# EAGLE design NSL_MiniQuad (EAGLE 5.11)

## Sheet 1 of 7
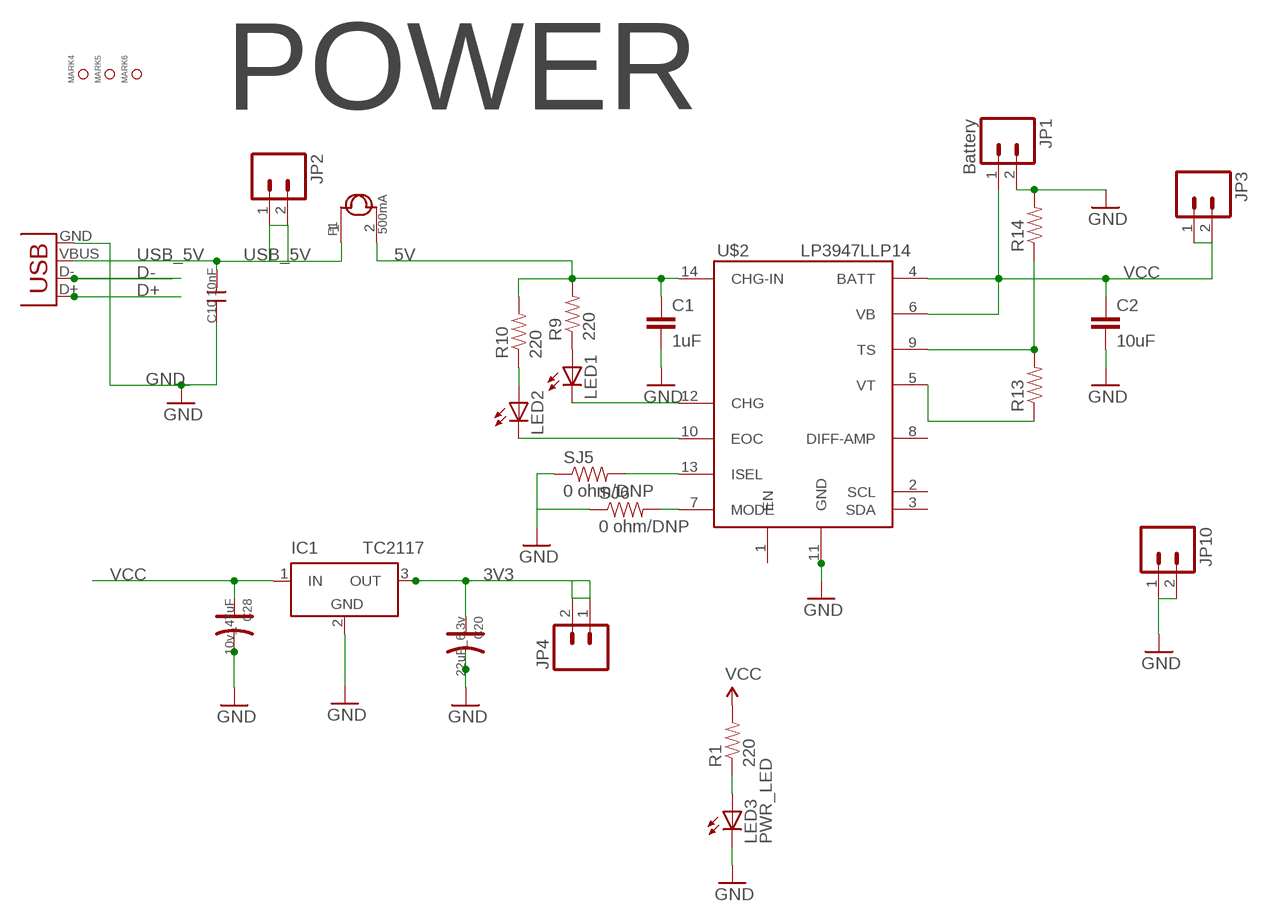
[diagram p0: schematic, sheet 1]

### Parts
C1  1uF  CAP0805  [0805]
C2  10uF  CAP0805  [0805]
C10  10nF  C-0805  [0805]
C20  22uF_6.3v  CAP_AVX_A  [AVX-A]
C28  10v_47uF  CAP_AVX_B  [AVX-B]
F1  500mA  FUSE-1206  [1206]
IC1  TC2117  LT1963EST-3.3  [SOT223]
JP1  Battery  M02POLAR  [MOLEX-1X2]
JP2  M021MM_MOTOR  [1MM_MOTOR]
JP3  M021MM_MOTOR  [1MM_MOTOR]
JP4  M021MM_MOTOR  [1MM_MOTOR]
JP10  M021MM_MOTOR  [1MM_MOTOR]
LED1  LEDCHIP-LED0603  [CHIP-LED0603]
LED2  LEDCHIP-LED0603  [CHIP-LED0603]
LED3  PWR_LED  LEDCHIP-LED0603  [CHIP-LED0603]
MARK4  DNP  PAD-MARK-30  [MARK_30]
MARK5  DNP  PAD-MARK-30  [MARK_30]
MARK6  DNP  PAD-MARK-30  [MARK_30]
R1  220  RESISTOR  [0805]
R9  220  RESISTOR  [0805]
R10  220  RESISTOR  [0805]
R13  RESISTOR  [0805]
R14  RESISTOR  [0805]
SJ5  0 ohm/DNP  RESISTOR0402-RES  [0402-RES]
SJ6  0 ohm/DNP  RESISTOR0402-RES  [0402-RES]
U$2  LP3947LLP14  [LLP14]
X1  USBSMD  [USB-MINIB]

### Nets
3V3: C20.+ IC1.3(OUT) JP4.1 JP4.2 ; also sheet 2,3,4,5
5V: C1.1 F1.2 R9.2 R10.2 U$2.14(CHG-IN) ; also sheet 3
D+: X1.D+ ; also sheet 3
D-: X1.D- ; also sheet 3
GND: C1.2 C2.2 C10.1 C20.- C28.- IC1.2(GND) JP1.2 JP10.1 JP10.2 LED3.C R14.2 SJ5.1 SJ6.1 U$2.11(GND) X1.GND ; also sheet 2,3,4,5,6
N$6: LED1.A R9.1
N$7: LED2.A R10.1
N$8: LED1.C U$2.12(CHG)
N$9: LED2.C U$2.10(EOC)
N$10: LED3.A R1.1
N$11: R13.1 U$2.5(VT)
N$12: R13.2 R14.1 U$2.9(TS)
N$27: SJ5.2 U$2.13(ISEL)
N$32: SJ6.2 U$2.7(MODE)
USB_5V: C10.2 F1.1 JP2.1 JP2.2 X1.VBUS
VCC: C2.1 C28.+ IC1.1(IN) JP1.1 JP3.1 JP3.2 R1.2 U$2.4(BATT) U$2.6(VB) ; also sheet 6
Unconnected: U$2.1(EN) U$2.2(SCL) U$2.3(SDA) U$2.8(DIFF-AMP)

### Notes on the sheet
- POWER

## Sheet 2 of 7
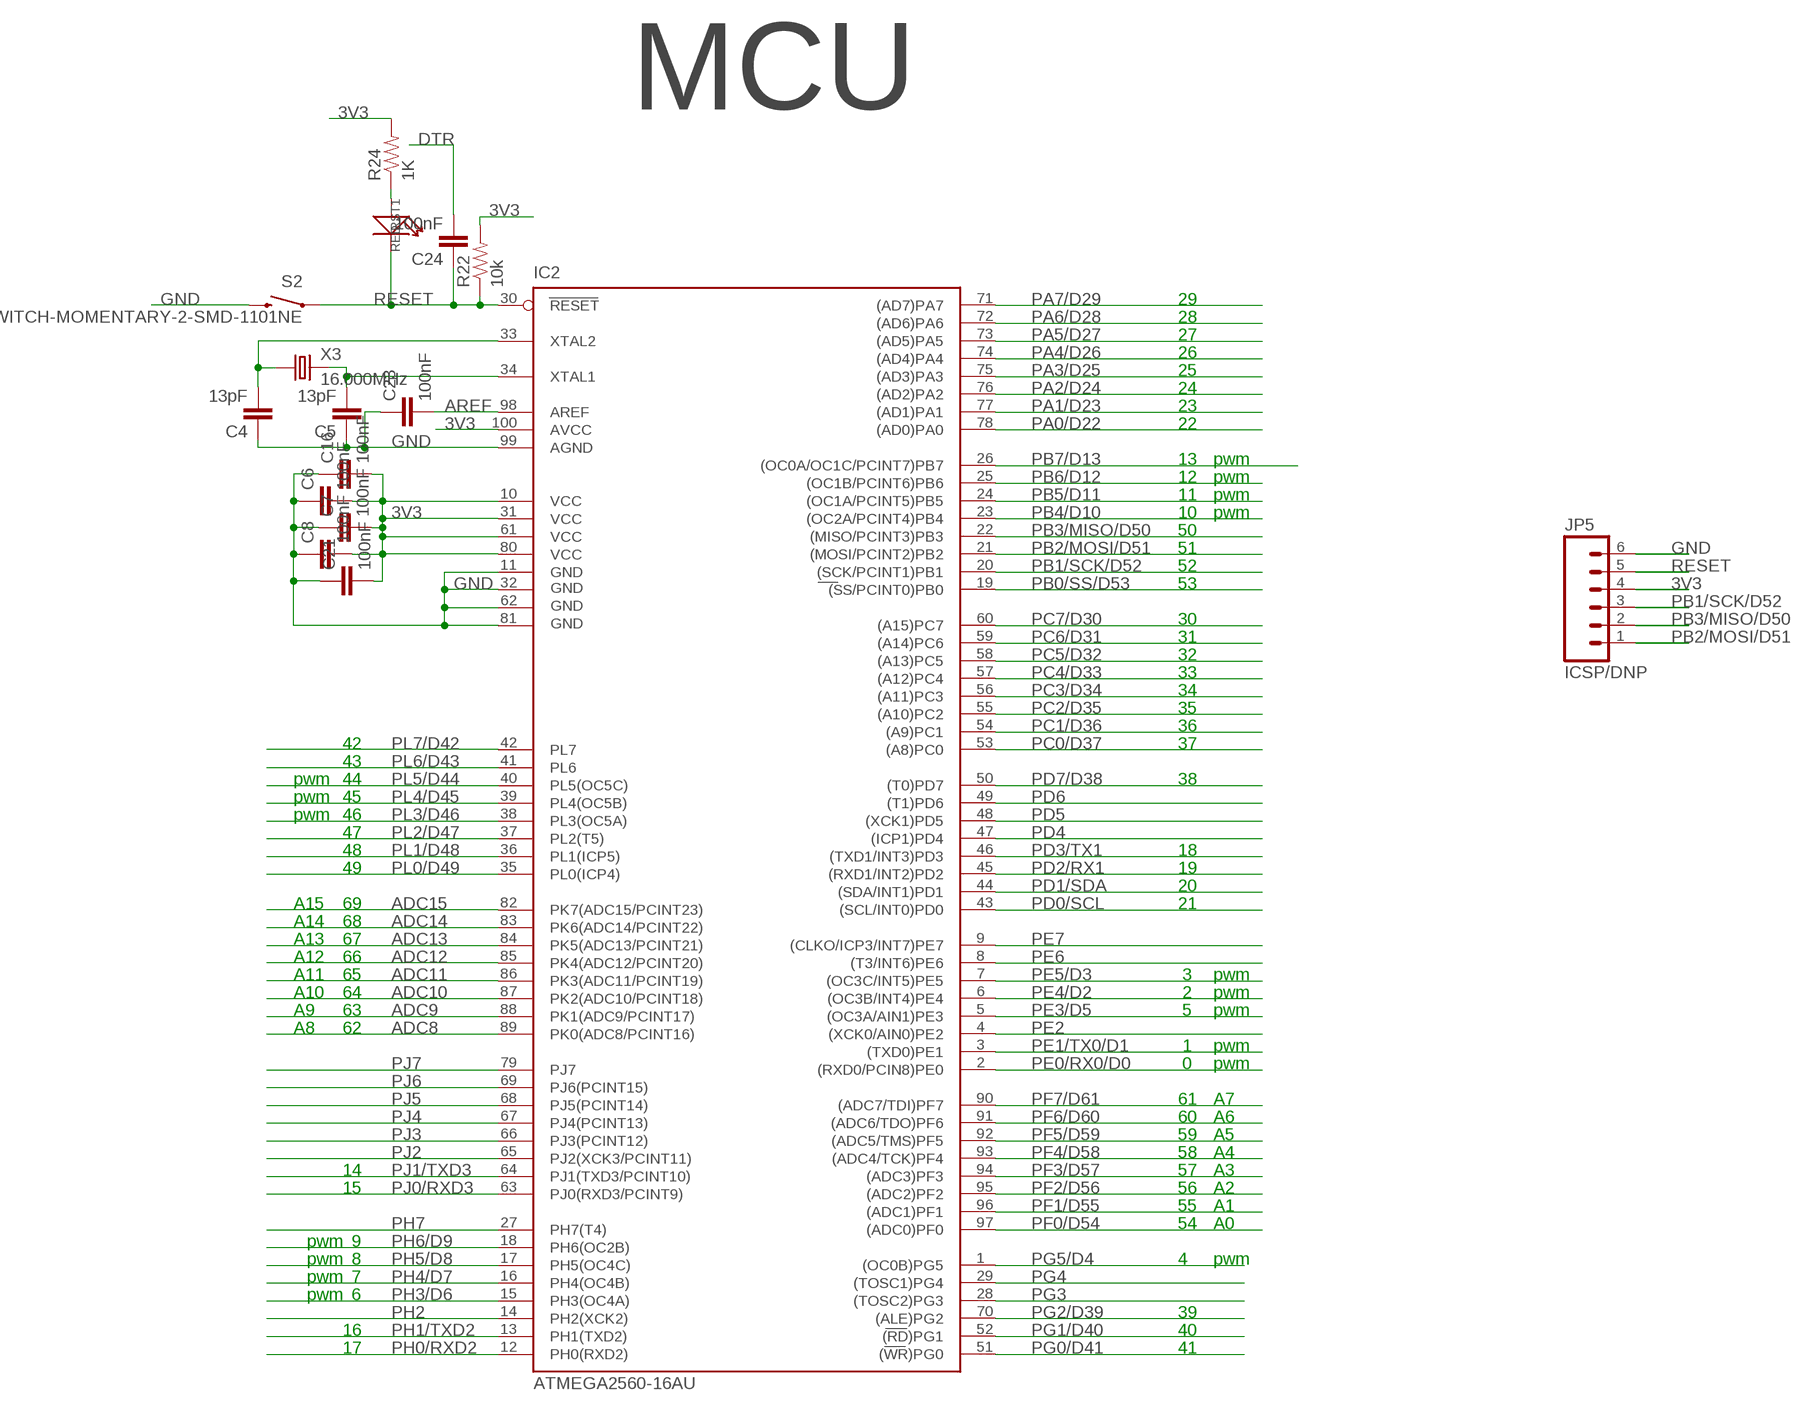
[diagram p1: schematic, sheet 2]

### Parts
C4  13pF  CAP0805  [0805]
C5  13pF  CAP0805  [0805]
C6  100nF  CAP0805  [0805]
C7  100nF  CAP0805  [0805]
C8  100nF  CAP0805  [0805]
C16  100nF  CAP0805  [0805]
C21  100nF  CAP0805  [0805]
C23  100nF  CAP0805  [0805]
C24  100nF  CAP0805  [0805]
IC2  ATMEGA2560-16AU  ATMEGA1280-16AU  [TQFP100]
JP5  ICSP/DNP  M061X06-SMD_EDGE_FEMALE  [1X06-SMD_EDGE]
R22  10k  RESISTOR  [0805]
R24  1K  RESISTOR  [0805]
RST1  RED  LED-0603  [D0603]
S2  SWITCH-MOMENTARY-2-SMD-1101NE  [TACTILE-SWITCH-1101NE]
X3  16.000MHz  CRYSTAL-5032  [5032]

### Nets
3V3: C6.2 C7.2 C8.2 C16.2 C21.2 IC2.10(VCC) IC2.31(VCC1) IC2.61(VCC2) IC2.80(VCC3) IC2.100(AVCC) JP5.4 R22.2 R24.2 ; also sheet 1,3,4,5
ADC8: IC2.89(PK0(ADC8/PCINT16))
ADC9: IC2.88(PK1(ADC9/PCINT17))
ADC10: IC2.87(PK2(ADC10/PCINT18))
ADC11: IC2.86(PK3(ADC11/PCINT19))
ADC12: IC2.85(PK4(ADC12/PCINT20))
ADC13: IC2.84(PK5(ADC13/PCINT21))
ADC14: IC2.83(PK6(ADC14/PCINT22))
ADC15: IC2.82(PK7(ADC15/PCINT23))
AREF: C23.2 IC2.98(AREF)
DTR: C24.2 ; also sheet 3
GND: C4.1 C5.1 C6.1 C7.1 C8.1 C16.1 C21.1 C23.1 IC2.11(GND) IC2.32(GND1) IC2.62(GND2) IC2.81(GND3) IC2.99(AGND) JP5.6 S2.P$2 ; also sheet 1,3,4,5,6
N$16: C5.2 IC2.34(XTAL1) X3.2
N$17: C4.2 IC2.33(XTAL2) X3.1
N$19: R24.1 RST1.+
PA0/D22: IC2.78((AD0)PA0)
PA1/D23: IC2.77((AD1)PA1)
PA2/D24: IC2.76((AD2)PA2)
PA3/D25: IC2.75((AD3)PA3) ; also sheet 7
PA4/D26: IC2.74((AD4)PA4) ; also sheet 7
PA5/D27: IC2.73((AD5)PA5)
PA6/D28: IC2.72((AD6)PA6)
PA7/D29: IC2.71((AD7)PA7)
PB0/SS/D53: IC2.19((SS/PCINT0)PB0)
PB1/SCK/D52: IC2.20((SCK/PCINT1)PB1) JP5.3
PB2/MOSI/D51: IC2.21((MOSI/PCINT2)PB2) JP5.1
PB3/MISO/D50: IC2.22((MISO/PCINT3)PB3) JP5.2
PB4/D10: IC2.23((OC2A/PCINT4)PB4)
PB5/D11: IC2.24((OC1A/PCINT5)PB5) ; also sheet 7
PB6/D12: IC2.25((OC1B/PCINT6)PB6) ; also sheet 7
PB7/D13: IC2.26((OC0A/OC1C/PCINT7)PB7)
PC0/D37: IC2.53((A8)PC0)
PC1/D36: IC2.54((A9)PC1)
PC2/D35: IC2.55((A10)PC2)
PC3/D34: IC2.56((A11)PC3)
PC4/D33: IC2.57((A12)PC4)
PC5/D32: IC2.58((A13)PC5)
PC6/D31: IC2.59((A14)PC6)
PC7/D30: IC2.60((A15)PC7)
PD0/SCL: IC2.43((SCL/INT0)PD0) ; also sheet 5
PD1/SDA: IC2.44((SDA/INT1)PD1) ; also sheet 5
PD2/RX1: IC2.45((RXD1/INT2)PD2) ; also sheet 4
PD3/TX1: IC2.46((TXD1/INT3)PD3) ; also sheet 4
PD4: IC2.47((ICP1)PD4)
PD5: IC2.48((XCK1)PD5)
PD6: IC2.49((T1)PD6) ; also sheet 7
PD7/D38: IC2.50((T0)PD7) ; also sheet 7
PE0/RX0/D0: IC2.2((RXD0/PCIN8)PE0) ; also sheet 3
PE1/TX0/D1: IC2.3((TXD0)PE1) ; also sheet 3
PE2: IC2.4((XCK0/AIN0)PE2)
PE3/D5: IC2.5((OC3A/AIN1)PE3) ; also sheet 6
PE4/D2: IC2.6((OC3B/INT4)PE4) ; also sheet 6
PE5/D3: IC2.7((OC3C/INT5)PE5) ; also sheet 6
PE6: IC2.8((T3/INT6)PE6) ; also sheet 7
PE7: IC2.9((CLKO/ICP3/INT7)PE7) ; also sheet 7
PF0/D54: IC2.97((ADC0)PF0)
PF1/D55: IC2.96((ADC1)PF1)
PF2/D56: IC2.95((ADC2)PF2)
PF3/D57: IC2.94((ADC3)PF3)
PF4/D58: IC2.93((ADC4/TCK)PF4)
PF5/D59: IC2.92((ADC5/TMS)PF5)
PF6/D60: IC2.91((ADC6/TDO)PF6)
PF7/D61: IC2.90((ADC7/TDI)PF7)
PG0/D41: IC2.51((WR)PG0) ; also sheet 5
PG1/D40: IC2.52((RD)PG1)
PG2/D39: IC2.70((ALE)PG2)
PG3: IC2.28((TOSC2)PG3)
PG4: IC2.29((TOSC1)PG4)
PG5/D4: IC2.1((OC0B)PG5) ; also sheet 6
PH0/RXD2: IC2.12(PH0(RXD2))
PH1/TXD2: IC2.13(PH1(TXD2))
PH2: IC2.14(PH2(XCK2))
PH3/D6: IC2.15(PH3(OC4A))
PH4/D7: IC2.16(PH4(OC4B))
PH5/D8: IC2.17(PH5(OC4C))
PH6/D9: IC2.18(PH6(OC2B))
PH7: IC2.27(PH7(T4))
PJ0/RXD3: IC2.63(PJ0(RXD3/PCINT9)) ; also sheet 5
PJ1/TXD3: IC2.64(PJ1(TXD3/PCINT10)) ; also sheet 5
PJ2: IC2.65(PJ2(XCK3/PCINT11))
PJ3: IC2.66(PJ3(PCINT12))
PJ4: IC2.67(PJ4(PCINT13))
PJ5: IC2.68(PJ5(PCINT14))
PJ6: IC2.69(PJ6(PCINT15))
PJ7: IC2.79(PJ7)
PL0/D49: IC2.35(PL0(ICP4))
PL1/D48: IC2.36(PL1(ICP5))
PL2/D47: IC2.37(PL2(T5))
PL3/D46: IC2.38(PL3(OC5A))
PL4/D45: IC2.39(PL4(OC5B))
PL5/D44: IC2.40(PL5(OC5C))
PL6/D43: IC2.41(PL6)
PL7/D42: IC2.42(PL7)
RESET: C24.1 IC2.30(RESET) JP5.5 R22.1 RST1.- S2.P$1

### Notes on the sheet
- MCU
- 29
- 28
- 27
- 26
- 25
- 24
- 23
- 22
- 13 | pwm
- 12 | pwm
- 11 | pwm
- 10 | pwm
- 50
- 51
- 52
- 53
- 30
- 31
- 32
- 33
- 34
- 35
- 36
- 42 | 37
- 43
- pwm | 44 | 38
- pwm | 45
- pwm | 46
- 47
- 48 | 18
- 49 | 19
- 20
- A15 | 69 | 21
- A14 | 68
- A13 | 67
- A12 | 66
- A11 | 65 | 3 | pwm
- A10 | 64 | 2 | pwm
- A9 | 63 | 5 | pwm
- A8 | 62
- 1 | pwm
- 0 | pwm
- 61 | A7
- 60 | A6
- 59 | A5
- 58 | A4
- 14 | 57 | A3
- 15 | 56 | A2
- 55 | A1
- 54 | A0
- pwm | 9
- pwm | 8 | 4 | pwm
- pwm | 7
- pwm | 6
- 39
- 16 | 40
- 17 | 41

## Sheet 3 of 7
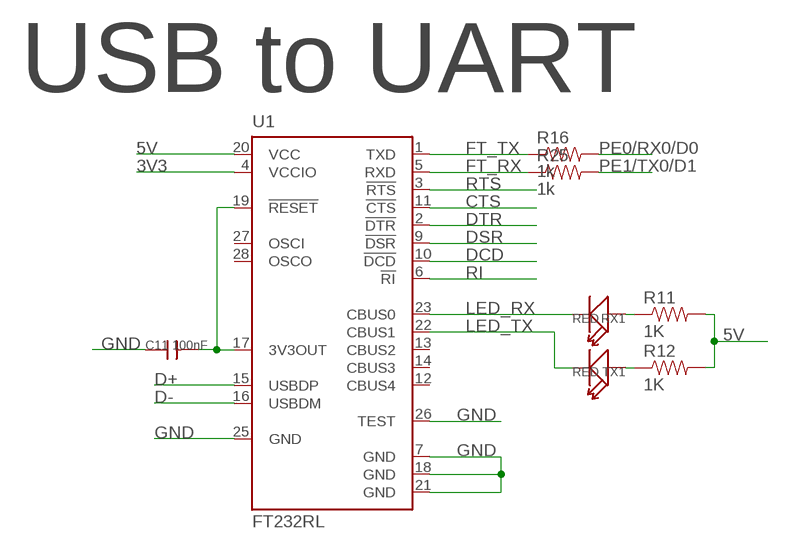
[diagram p2: schematic, sheet 3]

### Parts
C11  100nF  C-0805  [0805]
R11  1K  RESISTOR  [0805]
R12  1K  RESISTOR  [0805]
R16  1k  RESISTOR  [0805]
R25  1k  RESISTOR  [0805]
RX1  RED  LED-0603  [D0603]
TX1  RED  LED-0603  [D0603]
U1  FT232RL  [SSOP28]

### Nets
3V3: U1.4(VCCIO) ; also sheet 1,2,4,5
5V: R11.2 R12.2 U1.20(VCC) ; also sheet 1
CTS: U1.11(!CTS)
D+: U1.15(USBDP) ; also sheet 1
D-: U1.16(USBDM) ; also sheet 1
DCD: U1.10(!DCD)
DSR: U1.9(!DSR)
DTR: U1.2(!DTR) ; also sheet 2
FT_RX: R25.1 U1.5(RXD)
FT_TX: R16.1 U1.1(TXD)
GND: C11.1 U1.7(GND) U1.18(GND) U1.21(GND) U1.25(GND) U1.26(TEST) ; also sheet 1,2,4,5,6
LED_RX: RX1.- U1.23(CBUS0)
LED_TX: TX1.- U1.22(CBUS1)
N$2: C11.2 U1.17(3V3OUT) U1.19(!RESET)
N$3: R12.1 TX1.+
N$20: R11.1 RX1.+
PE0/RX0/D0: R16.2 ; also sheet 2
PE1/TX0/D1: R25.2 ; also sheet 2
RI: U1.6(!RI)
RTS: U1.3(!RTS)
Unconnected: U1.12(CBUS4) U1.13(CBUS2) U1.14(CBUS3) U1.27(OSCI) U1.28(OSCO)

### Notes on the sheet
- USB to UART

## Sheet 4 of 7
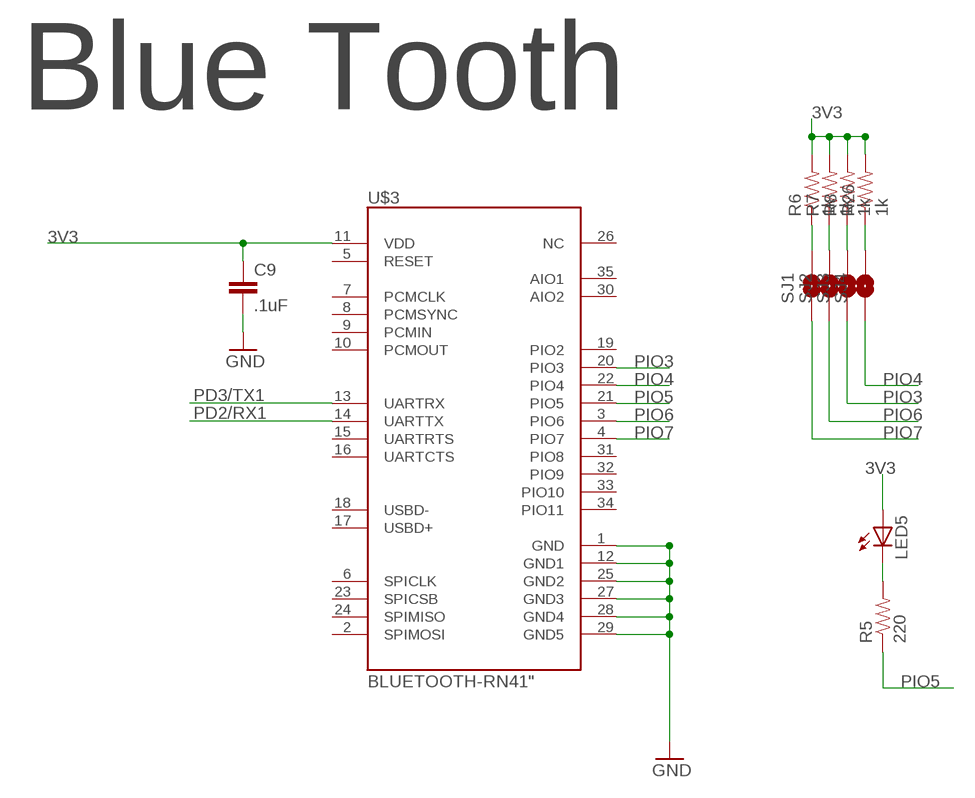
[diagram p3: schematic, sheet 4]

### Parts
C9  .1uF  CAP0805  [0805]
LED5  LEDCHIP-LED0603  [CHIP-LED0603]
R5  220  RESISTOR  [0805]
R6  1k  RESISTOR  [0805]
R7  1k  RESISTOR  [0805]
R8  1k  RESISTOR  [0805]
R26  1k  RESISTOR  [0805]
SJ1  SOLDERJUMPERNO  [SJ_2S-NO]
SJ2  SOLDERJUMPERNO  [SJ_2S-NO]
SJ3  SOLDERJUMPERNO  [SJ_2S-NO]
SJ4  SOLDERJUMPERNO  [SJ_2S-NO]
U$3  BLUETOOTH-RN41"  [RN41]

### Nets
3V3: C9.1 LED5.A R6.2 R7.2 R8.2 R26.2 U$3.11(VDD) ; also sheet 1,2,3,5
GND: C9.2 U$3.1(GND) U$3.12(GND1) U$3.25(GND2) U$3.27(GND3) U$3.28(GND4) U$3.29(GND5) ; also sheet 1,2,3,5,6
N$1: LED5.C R5.2
N$21: R8.1 SJ3.2
N$22: R6.1 SJ1.2
N$23: R7.1 SJ2.2
N$24: R26.1 SJ4.2
PD2/RX1: U$3.14(UARTTX) ; also sheet 2
PD3/TX1: U$3.13(UARTRX) ; also sheet 2
PIO3: SJ3.1 U$3.20(PIO3)
PIO4: SJ4.1 U$3.22(PIO4)
PIO5: R5.1 U$3.21(PIO5)
PIO6: SJ2.1 U$3.3(PIO6)
PIO7: SJ1.1 U$3.4(PIO7)
Unconnected: U$3.2(SPIMOSI) U$3.5(RESET) U$3.6(SPICLK) U$3.7(PCMCLK) U$3.8(PCMSYNC) U$3.9(PCMIN) U$3.10(PCMOUT) U$3.15(UARTRTS) U$3.16(UARTCTS) U$3.17(USBD+) U$3.18(USBD-) U$3.19(PIO2) U$3.23(SPICSB) U$3.24(SPIMISO) U$3.26(NC) U$3.30(AIO2) U$3.31(PIO8) U$3.32(PIO9) U$3.33(PIO10) U$3.34(PIO11) U$3.35(AIO1)

### Notes on the sheet
- Blue Tooth

## Sheet 5 of 7
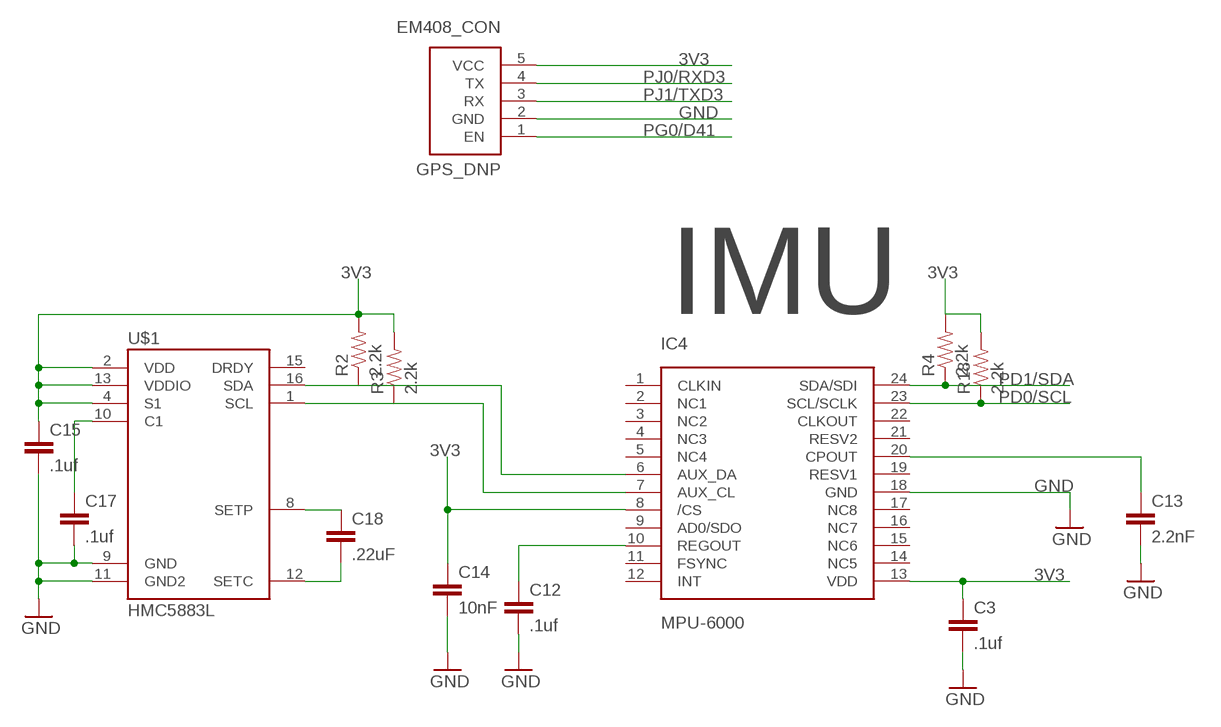
[diagram p4: schematic, sheet 5]

### Parts
C3  .1uf  CAP0805  [0805]
C12  .1uf  CAP0805  [0805]
C13  2.2nF  CAP0805  [0805]
C14  10nF  CAP0805  [0805]
C15  .1uf  CAP0805  [0805]
C17  .1uf  CAP0805  [0805]
C18  .22uF  CAP0805  [0805]
GPS_DNP  EM408_CON  [EM408_CON]
IC4  MPU-6000  [QFN-24]
R2  2.2k  RESISTOR  [0805]
R3  2.2k  RESISTOR  [0805]
R4  2.2k  RESISTOR  [0805]
R18  2.2k  RESISTOR  [0805]
U$1  HMC5883L  [LPCC16]

### Nets
3V3: C3.1 C14.1 C15.1 GPS_DNP.5(VCC) IC4.8(/CS) IC4.13(VDD) R2.2 R3.2 R4.2 R18.2 U$1.2(VDD) U$1.4(S1) U$1.13(VDDIO) ; also sheet 1,2,3,4
GND: C3.2 C12.2 C13.2 C14.2 C15.2 C17.2 GPS_DNP.2(GND) IC4.18(GND) U$1.9(GND) U$1.11(GND2) ; also sheet 1,2,3,4,6
N$15: C12.1 IC4.10(REGOUT)
N$18: C13.1 IC4.20(CPOUT)
N$25: IC4.6(AUX_DA) R2.1 U$1.16(SDA)
N$26: IC4.7(AUX_CL) R3.1 U$1.1(SCL)
N$34: C17.1 U$1.10(C1)
N$35: C18.1 U$1.8(SETP)
N$36: C18.2 U$1.12(SETC)
PD0/SCL: IC4.23(SCL/SCLK) R18.1 ; also sheet 2
PD1/SDA: IC4.24(SDA/SDI) R4.1 ; also sheet 2
PG0/D41: GPS_DNP.1(EN) ; also sheet 2
PJ0/RXD3: GPS_DNP.4(TX) ; also sheet 2
PJ1/TXD3: GPS_DNP.3(RX) ; also sheet 2
Unconnected: IC4.1(CLKIN) IC4.2(NC1) IC4.3(NC2) IC4.4(NC3) IC4.5(NC4) IC4.9(AD0/SDO) IC4.11(FSYNC) IC4.12(INT) IC4.14(NC5) IC4.15(NC6) IC4.16(NC7) IC4.17(NC8) IC4.19(RESV1) IC4.21(RESV2) IC4.22(CLKOUT) U$1.15(DRDY)

### Notes on the sheet
- IMU

## Sheet 6 of 7
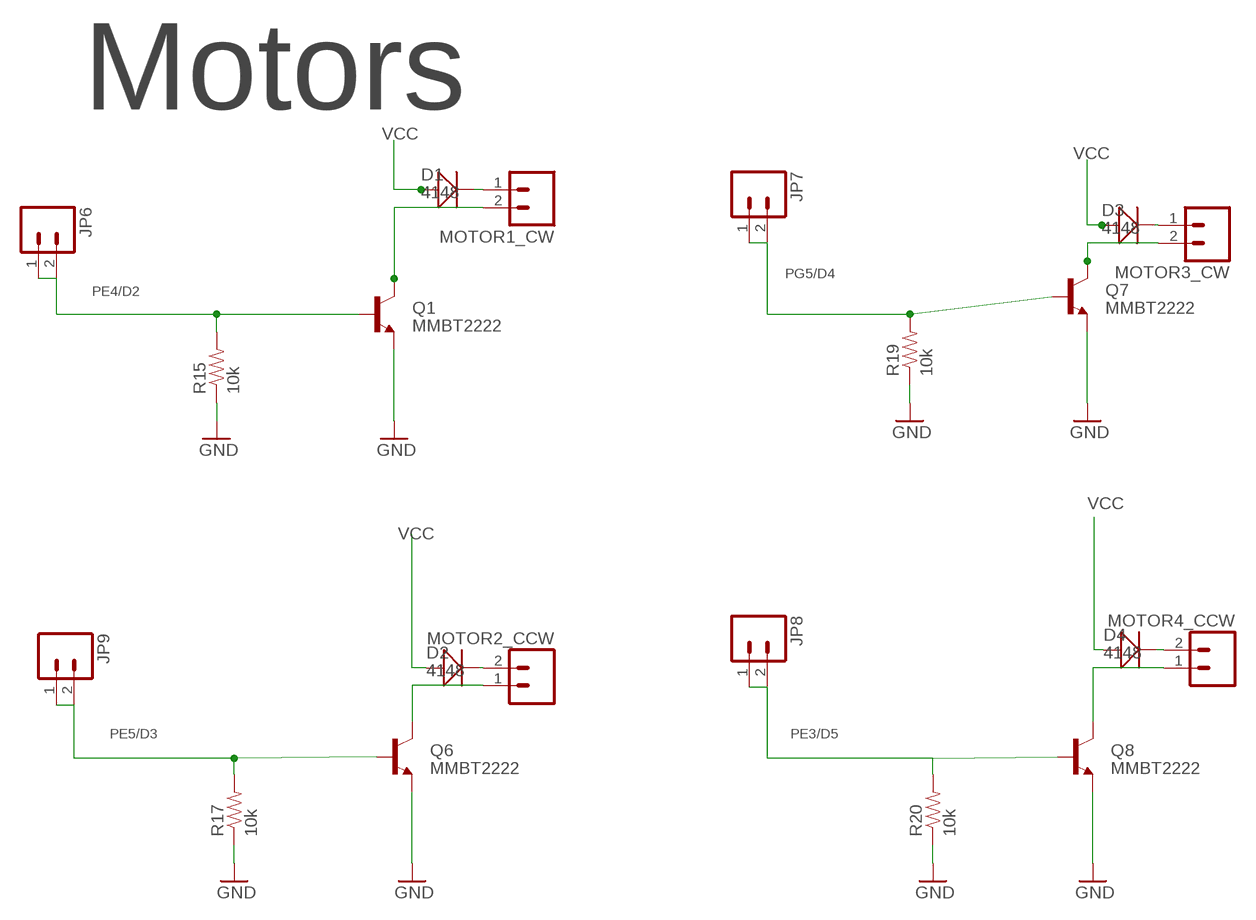
[diagram p5: schematic, sheet 6]

### Parts
D1  4148  D-SOD123  [SOD123]
D2  4148  D-SOD123  [SOD123]
D3  4148  D-SOD123  [SOD123]
D4  4148  D-SOD123  [SOD123]
JP6  M021MM_MOTOR  [1MM_MOTOR]
JP7  M021MM_MOTOR  [1MM_MOTOR]
JP8  M021MM_MOTOR  [1MM_MOTOR]
JP9  M021MM_MOTOR  [1MM_MOTOR]
MOTOR1_CW  M021MM_MOTOR  [1MM_MOTOR]
MOTOR2_CCW  M021MM_MOTOR  [1MM_MOTOR]
MOTOR3_CW  M021MM_MOTOR  [1MM_MOTOR]
MOTOR4_CCW  M021MM_MOTOR  [1MM_MOTOR]
Q1  MMBT2222  TRANSISTOR_NPNSOT23  [SOT23]
Q6  MMBT2222  TRANSISTOR_NPNSOT23  [SOT23]
Q7  MMBT2222  TRANSISTOR_NPNSOT23  [SOT23]
Q8  MMBT2222  TRANSISTOR_NPNSOT23  [SOT23]
R15  10k  RESISTOR  [0805]
R17  10k  RESISTOR  [0805]
R19  10k  RESISTOR  [0805]
R20  10k  RESISTOR  [0805]

### Nets
GND: Q1.2(E) Q6.2(E) Q7.2(E) Q8.2(E) R15.1 R17.1 R19.1 R20.1 ; also sheet 1,2,3,4,5
N$4: D1.- MOTOR1_CW.1
N$5: D2.- MOTOR2_CCW.2
N$13: D3.- MOTOR3_CW.1
N$14: D4.- MOTOR4_CCW.2
N$28: MOTOR2_CCW.1 Q6.3(C)
N$29: MOTOR1_CW.2 Q1.3(C)
N$30: MOTOR3_CW.2 Q7.3(C)
N$31: MOTOR4_CCW.1 Q8.3(C)
PE3/D5: JP8.1 JP8.2 Q8.1(B) R20.2 ; also sheet 2
PE4/D2: JP6.1 JP6.2 Q1.1(B) R15.2 ; also sheet 2
PE5/D3: JP9.1 JP9.2 Q6.1(B) R17.2 ; also sheet 2
PG5/D4: JP7.1 JP7.2 Q7.1(B) R19.2 ; also sheet 2
VCC: D1.+ D2.+ D3.+ D4.+ ; also sheet 1

### Notes on the sheet
- Motors

## Sheet 7 of 7
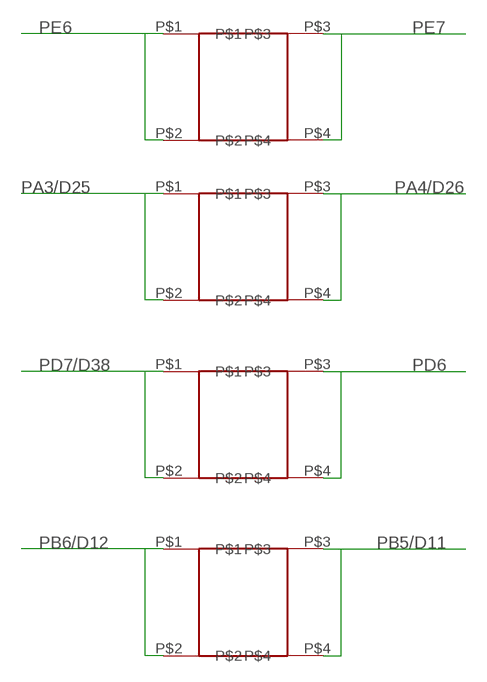
[diagram p6: schematic, sheet 7]

### Parts
U$8  SLOT  [SLOT]
U$9  SLOT  [SLOT]
U$10  SLOT  [SLOT]
U$11  SLOT  [SLOT]

### Nets
PA3/D25: U$9.P$1 U$9.P$2 ; also sheet 2
PA4/D26: U$9.P$3 U$9.P$4 ; also sheet 2
PB5/D11: U$11.P$3 U$11.P$4 ; also sheet 2
PB6/D12: U$11.P$1 U$11.P$2 ; also sheet 2
PD6: U$10.P$3 U$10.P$4 ; also sheet 2
PD7/D38: U$10.P$1 U$10.P$2 ; also sheet 2
PE6: U$8.P$1 U$8.P$2 ; also sheet 2
PE7: U$8.P$3 U$8.P$4 ; also sheet 2

## Power pins joined to a net without a drawn wire
GND: IC1.4(GND)

## Library data of the parts
C1-C9 C12-C18 C21 C23 C24 = SparkFun:CAP: Capacitor Standard 0603 ceramic capacitor, and 0.1" leaded capacitor.
C10 C11 = Discrete:C*: Ceramic Capacitors
C20 C28 = Discrete:CAP*: Electrolytic Capacitors,Tantalum Capacitors and Super Capacitors
D1-D4 = NSL_MiniQuad:D*
F1 = Discrete:FUSE
GPS_DNP = SparkFun:EM408_CON: This is the mating connector for the EM408 GPS receiver. The EM408 connects to the board via a cable, this connector footprint does not include the outline of the receiver. You should include the "EM408_Outline" device in your schematic if you are to use the EM408 in your design.
IC1 = linear-technology:LT1963EST: 1.5A, Low Noise, Fast Transient Response LDO Regulator Source: http://www.linear.com/pc/downloadDocument.do?navId=H0,C3,P2222,D3148
IC2 = ICs_v54:ATMEGA*: MICROCONTROLLER 64/128/256 Kbytes FLASH 4 Kbytes EEPROM 8 Kbytes SRAM 86 General Purpose I/O pins 12-channels16-bit PWM 4 x Serial USARTs 16-channels 10-bit A/D
IC4 = NSL_MiniQuad:MPU-6000: Invensense MPU-6000: 3-axis gyro, 3-axis accel & 9-axis MotionFusion The MPU-60X0 Motion Processing Unit (MPU?) is the world?s first motion processing solution with integrated 9-axis sensor fusion for handset and tablet applications, game controllers, motion pointer remote controls, and other consumer devices. The MPU-60X0 has an embedded 3-axis MEMS gyroscope, 3-axis MEMS accelerometer and Digital Motion Processor? (DMP) hardware accelerator engine with an auxiliary I 2 C port that interfaces to third party digital sensors, such as magnetometers. Interfacing with a 3-axis magnetometer delivers a complete 9-axis sensor fusion output to the MPU?s primary I 2 C or SPI port. (SPI is available on MPU-6000 only). This combines acceleration and rotational motion plus heading information into a single data stream for the application; DATASHEET: http://invensense.com/mems/gyro/documents/PS-MPU-6000A-00_v1.0.pdf; LINK: http://invensense.com/mems/gyro/mpu6000.html; MFGPN: MPU-6000
JP1 = SparkFun:M02: Header 2 Standard 2-pin 0.1" header. Use with straight break away headers (SKU : PRT-00116), right angle break away headers (PRT-00553), swiss pins (PRT-00743), machine pins (PRT-00117), and female headers (PRT-00115). Molex polarized connector foot print use with SKU : PRT-08233 with associated crimp pins and housings.
JP2-JP4 JP6-JP10 MOTOR1_CW MOTOR2_CCW MOTOR3_CW MOTOR4_CCW = NSL_MiniQuad:M02: Header 2 Standard 2-pin 0.1" header. Use with straight break away headers (SKU : PRT-00116), right angle break away headers (PRT-00553), swiss pins (PRT-00743), machine pins (PRT-00117), and female headers (PRT-00115). Molex polarized connector foot print use with SKU : PRT-08233 with associated crimp pins and housings.
JP5 = SparkFun:M06: Header 6 Standard 6-pin 0.1" header. Use with straight break away headers (SKU : PRT-00116), right angle break away headers (PRT-00553), swiss pins (PRT-00743), machine pins (PRT-00117), and female headers (PRT-00115). Molex polarized connector foot print use with SKU : PRT-08094 with associated crimp pins and housings. NOTES ON THE VARIANTS LOCK and LOCK_LONGPADS... This footprint was designed to help hold the alignment of a through-hole component (i.e. 6-pin header) while soldering it into place. You may notice that each hole has been shifted either up or down by 0.005 of an inch from it's more standard position (which is a perfectly straight line). This slight alteration caused the pins (the squares in the middle) to touch the edges of the holes. Because they are alternating, it causes a "brace" to hold the component in place. 0.005 has proven to be the perfect amount of "off-center" position when using our standard breakaway headers. Although looks a little odd when you look at the bare footprint, once you have a header in there, the alteration is very hard to notice. Also, if you push a header all the way into place, it is covered up entirely on the bottom side. This idea of altering the position of holes to aid alignment will be further integrated into the Sparkfun Library for other footprints. It can help hold any component with 3 or more connection pins.
LED1-LED3 LED5 = led:LED: LED OSRAM: - CHIPLED LG R971, LG N971, LY N971, LG Q971, LY Q971, LO R971, LY R971 LH N974, LH R974 LS Q976, LO Q976, LY Q976 LO Q996 - Hyper CHIPLED LW Q18S LB Q993, LB Q99A, LB R99A - SideLED LS A670, LO A670, LY A670, LG A670, LP A670 LB A673, LV A673, LT A673, LW A673 LH A674 LY A675 LS A676, LA A676, LO A676, LY A676, LW A676 LS A679, LY A679, LG A679 - Hyper Micro SIDELED® LS Y876, LA Y876, LO Y876, LY Y876 LT Y87S - SmartLED LW L88C, LW L88S LB L89C, LB L89S, LG L890 LS L89K, LO L89K, LY L89K LS L896, LA L896, LO L896, LY L896 - TOPLED LS T670, LO T670, LY T670, LG T670, LP T670 LSG T670, LSP T670, LSY T670, LOP T670, LYG T670 LG T671, LOG T671, LSG T671 LB T673, LV T673, LT T673, LW T673 LH T674 LS T676, LA T676, LO T676, LY T676, LB T676, LH T676, LSB T676, LW T676 LB T67C, LV T67C, LT T67C, LS T67K, LO T67K, LY T67K, LW E67C LS E67B, LA E67B, LO E67B, LY E67B, LB E67C, LV E67C, LT E67C LW T67C LS T679, LY T679, LG T679 LS T770, LO T770, LY T770, LG T770, LP T770 LB T773, LV T773, LT T773, LW T773 LH T774 LS E675, LA E675, LY E675, LS T675 LS T776, LA T776, LO T776, LY T776, LB T776 LHGB T686 LT T68C, LB T68C - Hyper Mini TOPLED® LB M676 - Mini TOPLED Santana® LG M470 LS M47K, LO M47K, LY M47K Source: http://www.osram.convergy.de LUXEON: - LUMILED® LXK2-PW12-R00, LXK2-PW12-S00, LXK2-PW14-U00, LXK2-PW14-V00 LXK2-PM12-R00, LXK2-PM12-S00, LXK2-PM14-U00 LXK2-PE12-Q00, LXK2-PE12-R00, LXK2-PE12-S00, LXK2-PE14-T00, LXK2-PE14-U00 LXK2-PB12-K00, LXK2-PB12-L00, LXK2-PB12-M00, LXK2-PB14-N00, LXK2-PB14-P00, LXK2-PB14-Q00 LXK2-PR12-L00, LXK2-PR12-M00, LXK2-PR14-Q00, LXK2-PR14-R00 LXK2-PD12-Q00, LXK2-PD12-R00, LXK2-PD12-S00 LXK2-PH12-R00, LXK2-PH12-S00 LXK2-PL12-P00, LXK2-PL12-Q00, LXK2-PL12-R00 Source: www.luxeon.com KINGBRIGHT: KA-3528ASYC Source: www.kingbright.com
MARK4-MARK6 = Discrete:PAD-MARK
Q1 Q6-Q8 = SparkFun:TRANSISTOR_NPN: Transistor NPN BJT configuration in SOT23 package. MMBT2222 is the common NPN we use. Double check BCE configuration again layout.
R1-R20 R22 R24-R26 = SparkFun:RESISTOR: Resistor Basic schematic elements and footprints for 0603, 1206, and PTH 1/10th watt (small) resistors.
RST1 RX1 TX1 = Discrete:LED*
S2 = SparkFun:SWITCH-MOMENTARY-2
SJ1-SJ4 = SparkFun:SOLDERJUMPER: Solder Jumper Standard SMD solder jumper. Used to automate production. Two varients : Normally Open and Normally Closed are the same, but have different paste layers. NC will have a large amount of paste and should jumper during reflow.
SJ5 SJ6 = NSL_MiniQuad:RESISTOR: Resistor Basic schematic elements and footprints for 0603, 1206, and PTH 1/10th watt (small) resistors.
U1 = ICs_v54:FT232R: Source: http://www.ftdichip.com/Documents/DataSheets/DS_FT232R_v104.pdf
U$1 = 3DRobotics_Master_Library:HMC5883L: Honeywell HMC5883L 3-axis digital compass IC Successor to the HMC5843.; DATASHEET: http://www.dsscircuits.com/images/datasheets/HMC5883L.pdf; LINK: http://parts.digikey.com/1/parts/2057013-ic-compass-3-axis-i2c-16lcc-smd-hmc5883l-tr.html; MFGPN: HMC5883L-TR
U$2 = NSL_MiniQuad:LP3947
U$3 = NSL_Mini_Quad:BLUETOOTH-RN41
U$8-U$11 = NSL_MiniQuad:SLOT
X1 = SparkFun:USB: USB Connectors USB-B-PTH is fully proven SKU : PRT-00139 USB-miniB is fully proven SKU : PRT-00587 USB-A-PCB is untested. USB-A-H is throughly reviewed, but untested. Spark Fun Electronics SKU : PRT-00437 USB-B-SMT is throughly reviewed, but untested. Needs silkscreen touching up. USB-A-S has not been used/tested USB-MB-H has not been used/tested
X3 = NSL_MiniQuad:CRYSTAL*: CRYSTAL

## Board
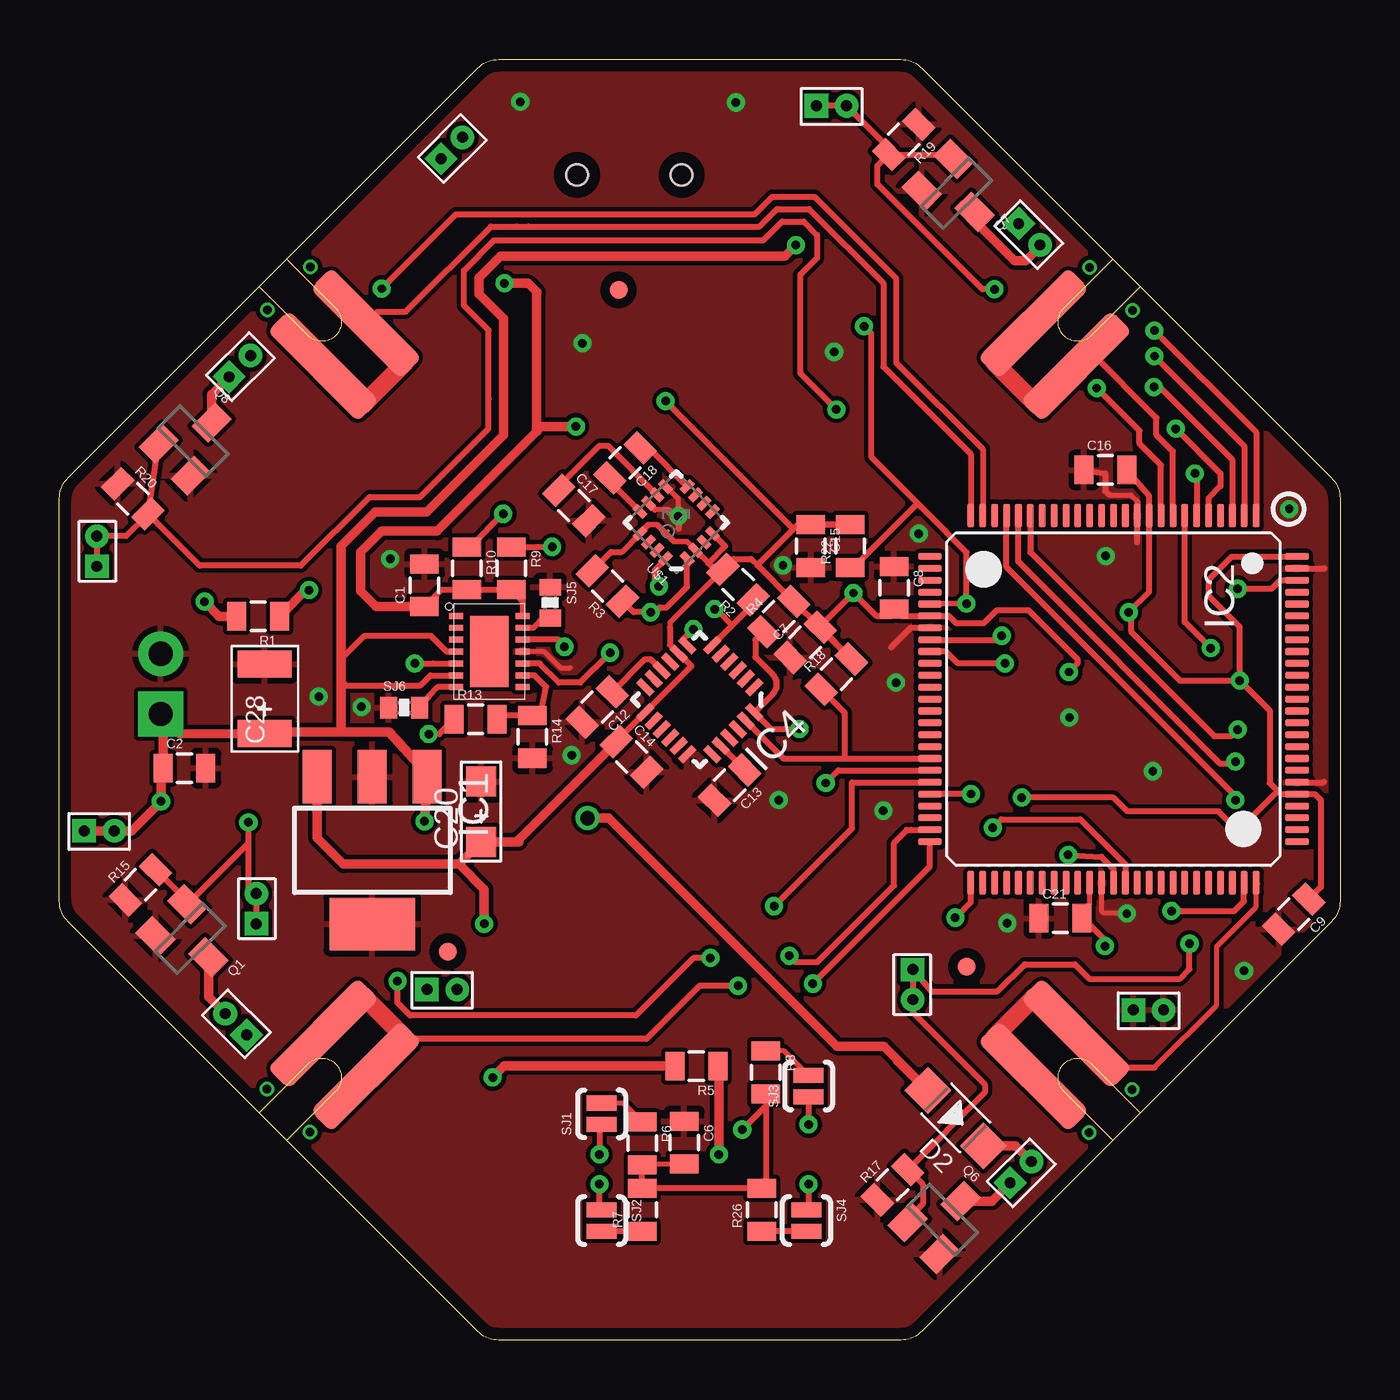
[diagram p7: board, top side]
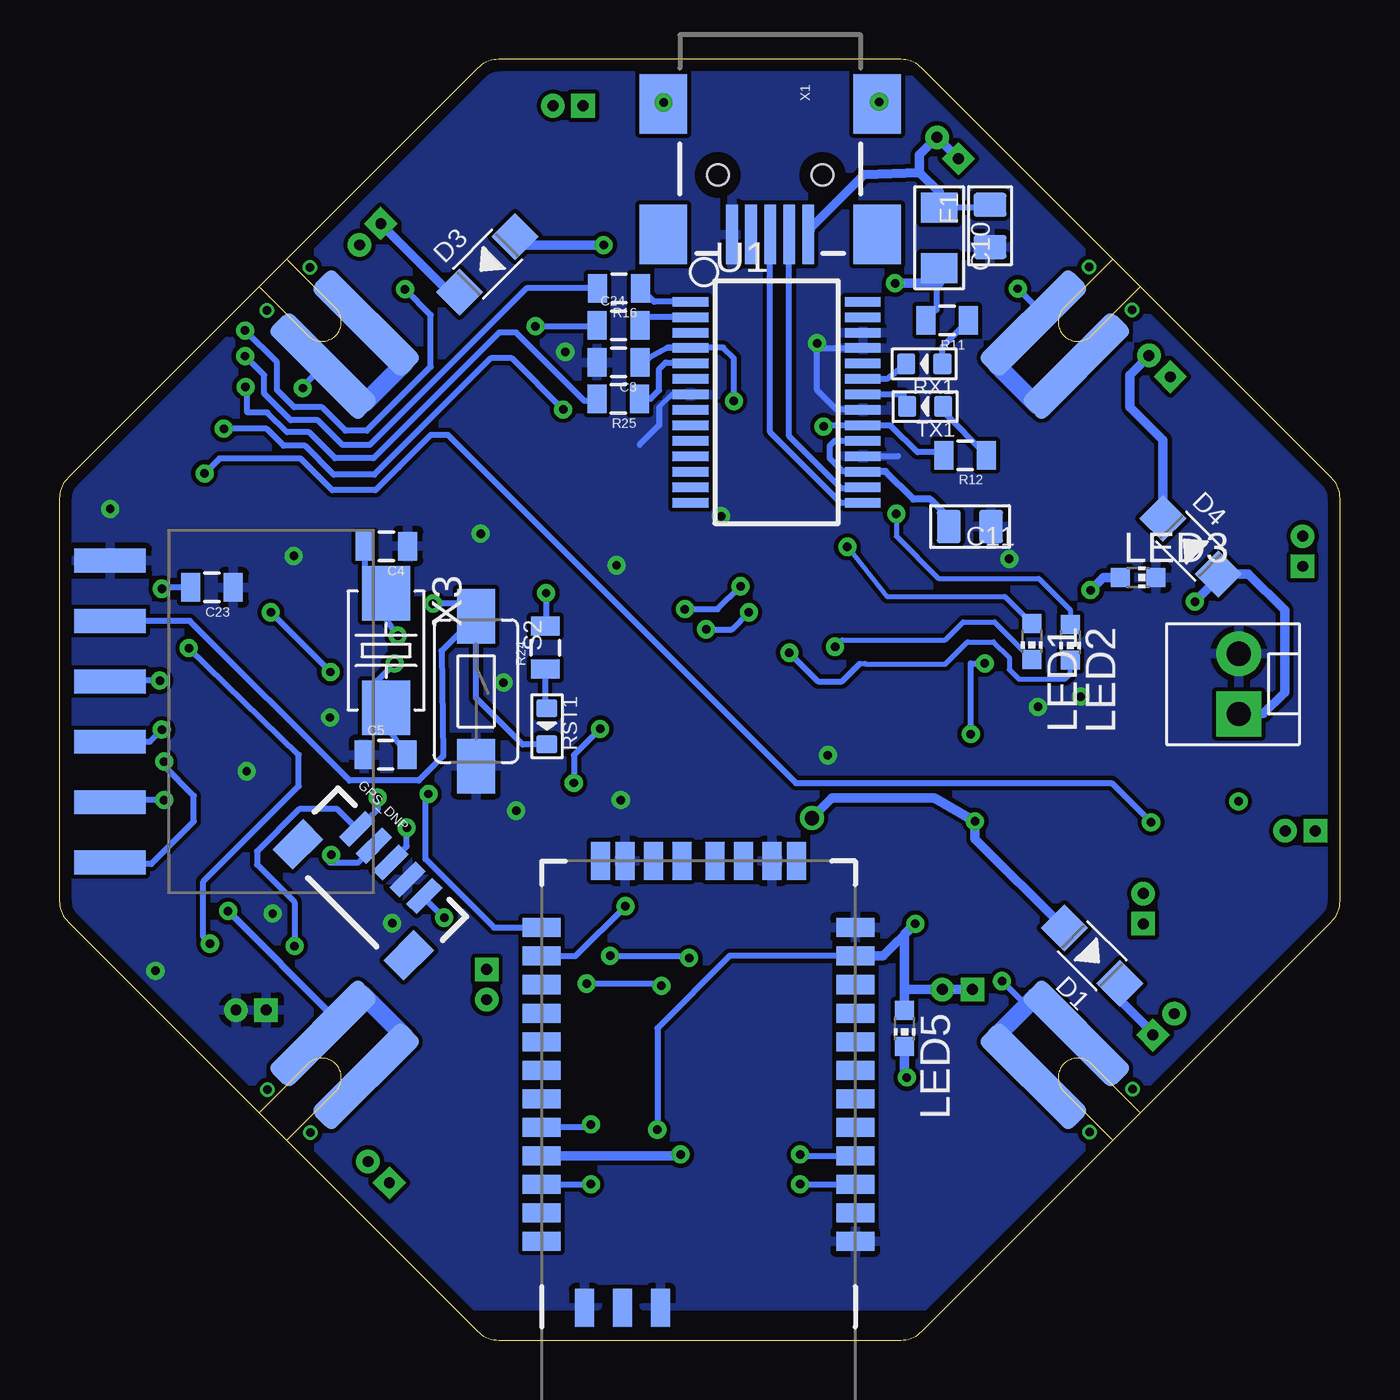
[diagram p8: board, bottom side, seen from below]

Size 53.88 x 53.88 mm. Coordinates in mm from the lower left corner, seen from the top.
Outline: 0,35.4 arc-45 0.37,36.29 17.59,53.51 arc-45 18.49,53.88 35.39,53.88 arc-45 36.29,53.51 53.51,36.29 arc-45 53.88,35.4 53.88,18.49 arc-45 53.51,17.59 36.29,0.37 arc-45 35.39,0 18.49,0 arc-45 17.59,0.37 0.37,17.59 arc-45 0,18.49 0,35.4
Copper layers (1*16): Top 0.0356mm / dielectric 1.5011mm / Bottom 0.0356mm
Design rules "SilverCircuits-tented": minimum track width 7mil, minimum drill 14mil, track to track 7mil, track to pad 7mil, pad to pad 7mil, via to via 7mil, smd to smd 0mil, copper to edge 20mil, drill to drill 8mil, minimum pad ring 0mil, minimum via ring 8mil, stop-mask expansion 4mil, vias tented up to drill 14mil, thermal gap 10mil

### Footprints (pad centres in the part's own frame; a part is rotated, then mirrored left to right if it is on the bottom)
0805 = smd 0.8 x 1.2: 1 -0.9,0; 2 0.9,0
0805' = smd 1.016 x 1.397: 1 -0.889,0; 2 0.889,0
AVX-A = smd 1.27 x 1.27: + -1.27,0; - 1.27,0
AVX-B = smd 1.143 x 2.286: + -1.46,0; - 1.46,0
SOD123 = smd 1.397 x 1.397: + 1.651,0; - -1.651,0
1206 = smd 1.27 x 1.524: 1 -1.27,0; 2 1.27,0
EM408_CON = smd 0.6 x 1.55: 1 4,0; 2 3,0; 3 2,0; 4 1,0; 5 0,0 | smd 1.2 x 1.8: P$1 -1.3,-2.225; P$2 5.3,-2.225
SOT223 = smd 1.219 x 2.235: 1 -2.311,-3.099; 2 0,-3.099; 3 2.311,-3.099 | smd 3.6 x 2.2: 4 0,3.099
TQFP100 = smd 1 x 0.3: 1 -7.725,6; 2 -7.725,5.5; 3 -7.725,5; 4 -7.725,4.5; 5 -7.725,4; 6 -7.725,3.5; 7 -7.725,3; 8 -7.725,2.5; 9 -7.725,2; 10 -7.725,1.5; 11 -7.725,1; 12 -7.725,0.5; 13 -7.725,0; 14 -7.725,-0.5; 15 -7.725,-1; 16 -7.725,-1.5; 17 -7.725,-2; 18 -7.725,-2.5; 19 -7.725,-3; 20 -7.725,-3.5; 21 -7.725,-4; 22 -7.725,-4.5; 23 -7.725,-5; 24 -7.725,-5.5; 25 -7.725,-6; 51 7.725,-6; 52 7.725,-5.5; 53 7.725,-5; 54 7.725,-4.5; 55 7.725,-4; 56 7.725,-3.5; 57 7.725,-3; 58 7.725,-2.5; 59 7.725,-2; 60 7.725,-1.5; 61 7.725,-1; 62 7.725,-0.5; 63 7.725,0; 64 7.725,0.5; 65 7.725,1; 66 7.725,1.5; 67 7.725,2; 68 7.725,2.5; 69 7.725,3; 70 7.725,3.5; 71 7.725,4; 72 7.725,4.5; 73 7.725,5; 74 7.725,5.5; 75 7.725,6 | smd 0.3 x 1: 26 -6,-7.725; 27 -5.5,-7.725; 28 -5,-7.725; 29 -4.5,-7.725; 30 -4,-7.725; 31 -3.5,-7.725; 32 -3,-7.725; 33 -2.5,-7.725; 34 -2,-7.725; 35 -1.5,-7.725; 36 -1,-7.725; 37 -0.5,-7.725; 38 0,-7.725; 39 0.5,-7.725; 40 1,-7.725; 41 1.5,-7.725; 42 2,-7.725; 43 2.5,-7.725; 44 3,-7.725; 45 3.5,-7.725; 46 4,-7.725; 47 4.5,-7.725; 48 5,-7.725; 49 5.5,-7.725; 50 6,-7.725; 76 6,7.725; 77 5.5,7.725; 78 5,7.725; 79 4.5,7.725; 80 4,7.725; 81 3.5,7.725; 82 3,7.725; 83 2.5,7.725; 84 2,7.725; 85 1.5,7.725; 86 1,7.725; 87 0.5,7.725; 88 0,7.725; 89 -0.5,7.725; 90 -1,7.725; 91 -1.5,7.725; 92 -2,7.725; 93 -2.5,7.725; 94 -3,7.725; 95 -3.5,7.725; 96 -4,7.725; 97 -4.5,7.725; 98 -5,7.725; 99 -5.5,7.725; 100 -6,7.725
QFN-24 = smd 0.8 x 0.3: 1 -2,1.25; 2 -2,0.75; 3 -2,0.25; 4 -2,-0.25; 5 -2,-0.75; 6 -2,-1.25; 13 2,-1.25; 14 2,-0.75; 15 2,-0.25; 16 2,0.25; 17 2,0.75; 18 2,1.25 | smd 0.3 x 0.8: 7 -1.25,-2; 8 -0.75,-2; 9 -0.25,-2; 10 0.25,-2; 11 0.75,-2; 12 1.25,-2; 19 1.25,2; 20 0.75,2; 21 0.25,2; 22 -0.25,2; 23 -0.75,2; 24 -1.25,2
MOLEX-1X2 = drill 1.016 pad 1.88 square: 1 0,0 | drill 1.016 pad 1.88 round: 2 2.54,0
1MM_MOTOR = drill 0.457 pad 0.991 square: 1 -0.635,0 | drill 0.457 pad 0.991 round: 2 0.635,0
1X06-SMD_EDGE = smd 1 x 3: 1 0,-0.08; 2 2.54,-0.08; 3 5.08,-0.08; 4 7.62,-0.08; 5 10.16,-0.08; 6 12.7,-0.08
CHIP-LED0603 = smd 0.8 x 0.8: A 0,-0.75; C 0,0.75
MARK_30 = smd 0.762 x 0.762: MARK 0,0
SOT23 = smd 1 x 1.4: 1 -0.95,-1.1; 2 0.95,-1.1; 3 0,1.1
D0603 = smd 0.762 x 0.889: + -0.762,0; - 0.762,0
TACTILE-SWITCH-1101NE = smd 2.3 x 1.6: P$1 -3.15,0; P$2 3.15,0
SJ_2S-NO = smd 0.635 x 1.27: 1 -0.45,0; 2 0.45,0
0402-RES = smd 0.7 x 0.9: 1 -0.65,0; 2 0.65,0
SSOP28 = smd 0.4 x 1.5: 1 -4.225,-3.625; 2 -3.575,-3.625; 3 -2.925,-3.625; 4 -2.275,-3.625; 5 -1.625,-3.625; 6 -0.975,-3.625; 7 -0.325,-3.625; 8 0.325,-3.625; 9 0.975,-3.625; 10 1.625,-3.625; 11 2.275,-3.625; 12 2.925,-3.625; 13 3.575,-3.625; 14 4.225,-3.625; 15 4.225,3.625; 16 3.575,3.625; 17 2.925,3.625; 18 2.275,3.625; 19 1.625,3.625; 20 0.975,3.625; 21 0.325,3.625; 22 -0.325,3.625; 23 -0.975,3.625; 24 -1.625,3.625; 25 -2.275,3.625; 26 -2.925,3.625; 27 -3.575,3.625; 28 -4.225,3.625
LPCC16 = smd 0.6 x 0.3: 1 -1.4,0.75; 2 -1.4,0.25; 3 -1.4,-0.25; 4 -1.4,-0.75; 9 1.4,-0.75; 10 1.4,-0.25; 11 1.4,0.25; 12 1.4,0.75 | smd 0.3 x 0.6: 5 -0.75,-1.4; 6 -0.25,-1.4; 7 0.25,-1.4; 8 0.75,-1.4; 13 0.75,1.4; 14 0.25,1.4; 15 -0.25,1.4; 16 -0.75,1.4
LLP14 = smd 3 x 1.6: 0 0,0 | smd 0.25 x 0.6: 1 1.5,1.4; 2 1,1.4; 3 0.5,1.4; 4 0,1.4; 5 -0.5,1.4; 6 -1,1.4; 7 -1.5,1.4; 8 -1.5,-1.4; 9 -1,-1.4; 10 -0.5,-1.4; 11 0,-1.4; 12 0.5,-1.4; 13 1,-1.4; 14 1.5,-1.4
RN41 = smd 0.8 x 1.6: 1 -6.6,-6.6; 2 -5.4,-6.6; 3 -4.2,-6.6; 4 -3,-6.6; 5 -1.8,-6.6; 6 -0.6,-6.6; 7 0.6,-6.6; 8 1.8,-6.6; 9 3,-6.6; 10 4.2,-6.6; 11 5.4,-6.6; 12 6.6,-6.6; 13 6.6,6.6; 14 5.4,6.6; 15 4.2,6.6; 16 3,6.6; 17 1.8,6.6; 18 0.6,6.6; 19 -0.6,6.6; 20 -1.8,6.6; 21 -3,6.6; 22 -4.2,6.6; 23 -5.4,6.6; 24 -6.6,6.6 | smd 1.6 x 0.8: 25 -9.4,4.8; 26 -9.4,3.2; 27 -9.4,1.6; 28 9.4,3.1; 29 9.4,-3.1; 30 9.4,-4.122; 31 9.4,-1.9; 32 9.4,-0.7; 33 9.4,0.7; 34 9.4,1.9; 35 9.4,4.122
SLOT = smd 5.385 x 1.27: P$1 4.267,1.27; P$2 4.267,-1.27 | smd 5.385 x 1.27 bottom: P$3 4.267,1.27; P$4 4.267,-1.27 | drill 0.356 pad 0.61 round: P$5 0.94,1.295; P$6 0.94,-1.27
USB-MINIB = smd 2.5 x 0.5: D+ 2.5,0; D- 2.5,0.8; GND 2.5,-1.6; ID 2.5,-0.8; VBUS 2.5,1.6 | smd 2.5 x 2: GND@1 -3,-4.5; GND@2 -3,4.5; GND@3 2.5,4.5; GND@4 2.5,-4.5 | hole 0.9: 0,2.2; 0,-2.2
5032 = smd 2.286 x 2.032: 1 -2.413,0; 2 2.413,0

### Placement (x,y rotation side)
C1  15.36,31.75 90 top
C2  5.26,24.07 0 top
C3  30.35,41.13 180 bottom
C4  40.13,33.4 180 bottom
C5  40.16,24.62 0 bottom
C6  26.29,8.31 270 top
C7  31.38,29.35 45 top
C8  35.11,31.65 270 top
C9  51.93,17.92 225 top
C10  10nF  [0805']  14.73,46.88 90 bottom
C11  100nF  [0805']  15.57,34.23 180 bottom
C12  22.63,26.63 225 top
C13  28.2,23.35 225 top
C14  24.07,24.53 315 top
C15  31.61,33.41 270 top
C16  44,36.61 0 top
C17  21.64,35.11 315 top
C18  23.8,36.91 225 top
C20  17.74,22.23 90 top
C21  42.12,17.74 0 top
C23  47.47,31.66 180 bottom
C24  30.35,42.69 0 bottom
C28  8.64,26.98 90 top
D1  10.44,16.17 135 bottom
D2  37.71,9.34 135 top
D3  35.87,45.26 45 bottom
D4  6.29,33.41 315 bottom
F1  16.87,46.38 270 bottom
GPS_DNP  41.36,21.51 315 bottom
IC1  13.16,20.6 180 top
IC2  44.35,26.97 270 top
IC4  26.94,26.94 225 top
JP1  4.26,26.34 90 bottom
JP2  16.51,50.15 45 top
JP3  1.68,21.43 0 top
JP4  16.1,14.75 0 top
JP5  51.83,20.09 90 bottom
JP6  8.28,18.15 90 top
JP7  32.49,51.93 0 top
JP8  1.57,33.19 90 top
JP9  35.91,14.96 270 top
JP10  45.82,13.88 0 top
LED1  12.97,29.39 180 bottom
LED2  11.36,29.37 180 bottom
LED3  8.49,32.09 270 bottom
LED5  18.32,13.11 180 bottom
MARK4  23.53,44.18 135 top
MARK5  38.17,15.72 135 top
MARK6  16.34,16.34 135 top
MOTOR1_CW  7.42,13.28 135 top
MOTOR2_CCW  40.45,7.06 45 top
MOTOR3_CW  40.81,46.53 315 top
MOTOR4_CCW  7.59,40.97 45 top
Q1  5.49,16.89 225 top
Q6  37.14,5.07 315 top
Q7  37.73,48.25 225 top
Q8  5.63,37.82 315 top
R1  8.37,30.45 180 top
R2  28.56,31.79 135 top
R3  23.06,31.73 135 top
R4  30.26,30.44 45 top
R5  26.8,11.53 180 top
R6  24.52,8.28 270 top
R7  24.52,5.48 90 top
R8  29.72,11.27 270 top
R9  19.02,32.47 270 top
R10  17.14,32.47 270 top
R11  16.53,42.9 180 bottom
R12  15.77,37.23 180 bottom
R13  17.51,26.12 0 top
R14  19.9,25.38 270 top
R15  3.41,19.15 45 top
R16  30.33,44.25 180 bottom
R17  35.06,6.54 45 top
R18  32.69,28.02 45 top
R19  35.52,50.51 225 top
R20  3.09,35.39 315 top
R22  33.28,33.41 90 top
R24  33.44,29.13 90 bottom
R25  30.37,39.6 180 bottom
R26  29.55,5.48 90 top
RST1  33.37,25.83 270 bottom
RX1  17.49,41.07 180 bottom
S2  36.35,27.3 270 bottom
SJ1  22.81,9.52 90 top
SJ2  22.81,5.03 270 top
SJ3  31.52,10.69 90 top
SJ4  31.43,5.03 270 top
SJ5  20.65,31.03 270 top
SJ6  14.5,26.61 0 top
TX1  17.46,39.28 180 bottom
U1  23.71,39.46 270 bottom
U$1  25.95,34.39 135 top
U$2  18.09,28.97 90 top
U$3  26.99,10.75 90 bottom
U$8  44.9,44.9 225 top
U$9  44.9,8.98 135 top
U$10  8.98,8.98 45 top
U$11  8.98,44.9 315 top
X1  23.98,49.02 270 bottom
X3  40.14,29.01 270 bottom

### Tracks (layer width: path | path; a pad name or v marks a point on that pad's centre or on a via)
3V3  (via drill 0.36)
  Top 0.203: R6.2 24.54,7.41 C6.2 | 29.72,9.85 R8.2 | IC2.61 43.35,18.37 43.2,18.23 43.2,17.93 C21.2 43.08,17.74 43.08,17.75 | 25.68,29.99 25.68,30.19 R2.2
  Top 0.229: U$1.2 26.41,33.59 25.86,33.59 25.14,34.3 24.79,34.3 24.43,33.95
  Top 0.254: 27.3,32.69 27.74,32.25 | U$1.2 27.3,32.69 | 27.74,32.25 R2.2 28.36,32.87 29.1,32.87 29.37,32.6 | 27.74,32.25 27.74,32.05 | 25.68,29.99 25.68,29.26 IC4.8 26.07,28.89 26.58,28.38 26.58,28.35 IC4.13 23.52,25.29 | R8.2 29.72,6.56 R26.2 R7.2 R6.2 | 29.37,32.6 30.88,31.08 R4.2 C7.2 R18.2 33.31,28.66 31.88,30.08 32.06,30.08 v33.41,31.43 | v49.66,27.75 50.56,26.85 50.92,26.49 50.92,23.44 51.25,23.1 | 51.25,23.1 51.39,22.97 IC2.80 52.82,22.97 53.07,22.72 53.07,19.06 C9.1 | v33.41,31.43 33.32,31.34 | v33.41,31.43 34.37,30.47 35.03,30.47 C8.2 35.39,30.47 IC2.31 37.42,30.47 37.72,30.17 38.89,30.17 39.43,30.71 40.77,30.71 42.84,28.65 42.84,28.47 v42.48,28.11 | C15.1 R22.2 31.07,34.31 30.89,34.13 | 29.37,32.6 30.89,34.13 | 30.89,34.13 v25.5,39.51 | 24.43,33.95 U$1.13 23.66,33.16 23.21,33.16 R3.2 | U$1.4 28.01,33.4 27.3,32.69 | IC2.100 52.06,32.96 49.32,32.96 48.36,32 48.36,31.31 49.66,30.01 v49.66,27.75 | v44.99,30.62 45.17,30.62 | v44.99,30.62 45.08,30.53 45.08,29.81 47.15,27.75 v49.66,27.75 | C16.2 45.85,35.52 IC2.10 45.85,31.48 v44.99,30.62 | 43.08,17.75 43.99,16.83 v43.99,16.58 | v40.49,22.83 44.35,22.83 44.93,22.24 48.77,22.24 49.2,21.81 49.96,21.81 51.25,23.1 | v28.73,8.86 29.72,9.85
  Top 0.406: IC1.3 10.85,21.12 11.94,20.03 16.81,20.03 | 16.81,20.03 C20.+ 19.33,20.96 19.33,21.07 C14.1 23.44,25.2 23.52,25.29 | v17.87,17.51 17.87,18.96 16.81,20.03
  Bottom 0.254: 28.29,41.76 U1.4 | 28.29,41.76 C3.1 29.27,41.31 29.1,41.31 28.29,41.76 | JP5.4 51.72,27.75 v49.66,27.75 | R24.2 33.41,30.07 v33.41,31.43 | 28.29,41.76 25.95,41.76 25.5,41.31 v25.5,39.51 | 20.48,16.16 25.68,16.16 28.73,13.12 v28.73,8.86 | v42.48,28.11 v44.99,30.62 | v40.49,22.83 40.49,22.33 GPS_DNP.5 42.19,22.34 43.79,22.34 45.57,20.57 45.57,20.01 43.99,18.43 v43.99,16.58
  Bottom 0.406: 18.32,14.82 18.32,17.06 v17.87,17.51 19.23,16.15 U$3.11 20.48,16.16 20.55,16.09 | 18.32,14.82 LED5.A | 18.32,14.82 18.24,14.75 JP4.2 JP4.1
5V  (via drill 0.36)
  Top 0.254: C1.1 16.07,31.57 R10.2 R9.2 19.49,31.1 U$2.14 | 20.3,38.44 20.12,38.26
  Top 0.305: C1.1 15.32,30.89
  Top 0.406: 20.12,38.26 20.08,38.22 | v21.73,38.44 20.3,38.44 | v18.72,44.46 19.71,44.46 20.09,44.09 20.08,44.08 U1.20 20.08,38.22 | 20.08,38.22 15.9,34.04 13.56,34.04 12.67,33.15 12.67,31.51 13.33,30.85 C1.1
  Bottom 0.254: v21.73,38.44 21.68,38.49 U1.20 18.91,38.49 17.78,37.36 16.8,37.36 R12.2 | R11.2 16.98,43.35 16.98,44.63
  Bottom 0.406: 16.98,44.63 F1.2 16.87,44.46 v18.72,44.46
AREF  (via drill 0.36)
  Top 0.254: IC2.98 51.37,31.97 51.01,31.61 v49.57,31.61
  Bottom 0.254: v49.57,31.61 49.52,31.66 C23.2
D+
  Bottom 0.254: X1.D+ 23.98,38.19 21,35.22 20.1,35.22 U1.15
D-
  Bottom 0.254: X1.D- 23.18,38.03 20.98,35.83 20.14,35.83 U1.16
DTR
  Bottom 0.254: U1.2 29.11,43.04 C24.2
FT_RX
  Bottom 0.254: U1.5 27.38,41.13 28.38,41.13 28.65,40.86 28.65,39.96 29.01,39.6 R25.1
FT_TX
  Bottom 0.254: U1.1 28.86,43.69 R16.1
GND  (via drill 0.36)
  Top 0.203: 45.35,35.3 45.08,35.56 44.18,35.56 | 25.59,34.93 25.06,34.93 | U$1.9 25.73,35.7 26.04,35.39 v26.04,34.66 | IC2.62 43.85,18.04 43.92,17.97 44.88,17.97 v44.91,17.95 | U$2.11 20.4,28.97 21.08,28.29 21.49,28.29
  Top 0.254: 26.05,34.13 v26.04,34.66 25.59,34.93 | 45.35,35.3 IC2.11 45.34,33.57 | 44.18,35.56 44,35.74 44,36.46 C16.1 | U$1.11 25.06,34.93 | IC2.81 53.2,23.47 53.21,23.49 | IC2.32 35.82,29.97 35,29.15 | IC2.99 53.23,32.47 53.24,32.48
  Bottom 0.203: U1.7 28.11,39.78 28.65,39.24
  Bottom 0.254: 29.47,37.67 28.65,38.49 28.65,39.24 | U1.21 20.11,39.16 21.18,39.16 22,39.98 v22,41.94 21.8,41.74 U1.25 | U1.18 18.61,37.19 18.59,37.2
  other vias: 35.2,27.66 30.44,32.6 30.26,22.72 13.91,32.87 36.16,33.93 51.74,34.97 34.66,22.27 21.55,24.61 42.5,26.19 49.84,15.54 32.6,41.58 39.88,17.54 28.46,52.07 19.39,52.09 46,23.93 10.91,27.07 12.71,26.64 44.02,32.99
  pour Top: -8.98,26.94 27.12,63.04 27.12,62.68 62.86,26.94 26.94,-8.98
  pour Bottom: 14.28,3.68 16.52,1.44 29.28,1.44 29.28,2.51 31.25,2.51 31.25,1.44 37.54,1.44 63.04,26.94 26.94,63.04 -9.16,26.94 14.19,3.59
LED_RX
  Bottom 0.254: RX1.- 19.07,40.44 U1.23
LED_TX
  Bottom 0.254: TX1.- 18.37,39.79 U1.22
N$1  (via drill 0.36)
  Top 0.406: v18.23,11.05 18.72,11.53 R5.2
  Bottom 0.406: LED5.C 18.32,11.14 v18.23,11.05
N$2
  Bottom 0.254: U1.17 20.1,36.55 20.92,36.55 21.46,37.09 21.46,37.63 21.25,37.84 U1.19
  Bottom 0.305: U1.17 19.13,36.55 17.96,35.38 17.24,35.38 16.46,34.6 C11.2
N$3
  Bottom 0.254: R12.1 16.7,39.06 TX1.+
N$4
  Bottom 0.406: D1.- 9.27,14.32 7.87,12.92 MOTOR1_CW.1
N$5
  Top 0.406: D2.- 40.23,8.18 MOTOR2_CCW.2
N$6  (via drill 0.36)
  Top 0.254: R9.1 20.15,33.37 v20.73,33.38
  Bottom 0.203: LED1.A 14.11,31.29 19.07,31.29 v20.73,33.38
N$7  (via drill 0.36)
  Top 0.254: v18.67,34.77 17.28,33.37 R10.1
  Bottom 0.203: v18.67,34.77 18.67,33.83 16.89,32.05 12.67,32.05 11.35,30.73 LED2.A
N$8  (via drill 0.36)
  Top 0.254: U$2.12 21,29.47 v21.25,29.17
  Bottom 0.203: v21.25,29.17 v21.24,29.17 20.95,29.46 16.61,29.46 15.85,30.22 14.54,30.22 LED1.C
N$9  (via drill 0.36)
  Top 0.254: U$2.10 20.21,28.47 21.01,27.66 21.91,27.66 v23.17,28.92
  Bottom 0.203: 20.45,28.22 20.21,28.47 19.99,28.47 19.96,28.44 16.61,28.44 15.67,29.38 14.58,29.38 13.92,28.72 13.92,28.21 13.51,27.8 11.58,27.8 11.35,28.03 LED2.C
  Bottom 0.254: 20.21,28.46 20.45,28.22 20.96,27.71 21.96,27.71 v23.17,28.92
N$10  (via drill 0.36)
  Top 0.406: R1.1 10.43,31.62 v10.5,31.55
  Bottom 0.406: v10.5,31.55 9.96,32.09 LED3.A
N$11  (via drill 0.36)
  Top 0.254: v14.95,28.47 15.71,28.47 U$2.5 | v15.54,25.5 15.98,25.5 R13.1
  Bottom 0.254: v15.54,25.5 15.54,28.47 v14.95,28.47
N$12
  Top 0.254: U$2.9 19.99,27.97 20.48,27.48 20.3,26.5 R14.1 18.57,26.28 R13.2
N$13
  Bottom 0.406: D3.- 37.67,44.1 37.67,44.29 MOTOR3_CW.1
N$14
  Bottom 0.406: D4.- 7.45,37.88 8.84,39.26 8.84,40.61 8.04,41.4 MOTOR4_CCW.2
N$15
  Top 0.254: IC4.10 24.88,28.65 24.64,28.65 C12.1
N$16  (via drill 0.36)
  Top 0.254: v39.78,28.47 37.81,28.47 37.31,28.97 IC2.34
  Bottom 0.254: 40.5,27.22 X3.2 40.14,25.86 C5.2 | 40.5,27.22 40.59,27.3 | v39.78,28.47 40.5,27.75 40.5,27.22
N$17  (via drill 0.36)
  Top 0.254: IC2.33 36.64,29.46 39.65,29.46 v39.65,29.63 arc90 39.57,29.71
  Bottom 0.254: X3.1 40.41,30.89 | X3.1 41.03,32.06 C4.2 | v39.65,29.63 40.14,30.32 X3.1
N$18
  Top 0.254: C13.1 IC4.20
N$19
  Bottom 0.254: RST1.+ 33.44,26.66 R24.1
N$20
  Bottom 0.254: R11.1 16.73,41.8 RX1.+
N$21
  Top 0.203: SJ3.2 30.49,12.17 R8.1
N$22
  Top 0.203: R6.1 23.73,9.97 SJ1.2
  Top 0.254: SJ1.2
N$23
  Top 0.254: R7.1 SJ2.2
N$24
  Top 0.254: SJ4.2 R26.1
N$25  (via drill 0.36)
  Top 0.254: R2.1 29.29,31.06 28.3,30.07 | IC4.6 28.3,30.07 | U$1.16 25.06,32.42 25.06,31.88 v25.22,31.71 | v27.57,30.75 27.75,30.62 28.3,30.07
  Bottom 0.254: v25.22,31.71 26.19,30.75 v27.57,30.75
N$26  (via drill 0.36)
  Top 0.254: IC4.7 26.41,29.27 26.22,29.46 v26.67,29.9 | R3.1 24.16,30.62 v24.88,30.62 24.97,30.53 25.26,30.83 25.55,30.83 26.41,31.69 U$1.1
  Bottom 0.254: v26.67,29.9 25.59,29.9 v24.88,30.62
N$27
  Top 0.254: U$2.13 19.94,29.97 20.4,30.42 20.94,30.42 SJ5.2
N$28
  Top 0.406: Q6.3 39.23,5.85 MOTOR2_CCW.1
N$29
  Top 0.406: Q1.3 6.27,14.44 MOTOR1_CW.2
N$30
  Top 0.406: Q7.3 38.51,47.08 40.18,45.41 40.66,45.41 41.26,46 MOTOR3_CW.2
N$31
  Top 0.406: Q8.3 6.4,39.79 MOTOR4_CCW.1
N$32
  Top 0.254: U$2.7 15.92,27.47 15.54,27.09 SJ6.2
N$34
  Top 0.254: U$1.10 23.07,37.63 22.72,37.63 21.01,35.91 C17.1
N$35
  Top 0.254: U$1.8 24.78,37.55 C18.1
N$36
  Top 0.254: U$1.12 23.16,36.13 C18.2
PA3/D25
  Top 0.203: 46.07,11.47 48.69,14.08 48.69,16.57 50.35,18.23 IC2.75
  Top 0.254: U$9.P$2 41.49,14.19 41.04,14.46 | U$9.P$1 39.33,12.75 | 46.07,11.47 44.21,11.47 44.09,11.58 | IC2.75 50.38,19.21
  Top 0.305: U$9.P$2 44.09,11.58
  Top 0.762: 39.33,12.75 41.04,14.46
PA4/D26  (via drill 0.36)
  Top 0.254: IC2.74 49.84,18.46 49.43,18.05 v46.79,18.05 | v46.79,18.05
  Bottom 0.254: 41.13,14.55 U$9.P$4 | U$9.P$3 39.33,12.75
  Bottom 0.305: v46.79,18.05 42.3,13.56 42.12,13.56 U$9.P$4
  Bottom 0.762: 39.33,12.75 41.13,14.55
PB1/SCK/D52  (via drill 0.36)
  Top 0.254: IC2.20 40.85,33.15 48.58,25.41 49.3,25.41 v49.57,25.68
  Bottom 0.254: v49.57,25.68 50.08,25.17 JP5.3
PB2/MOSI/D51  (via drill 0.36)
  Top 0.254: IC2.21 40.35,32.75 48.85,24.25 49.39,24.25 v49.48,24.34
  Bottom 0.254: v49.48,24.34 49.48,24.16 48.22,22.9 48.22,21.82 50.02,20.03 51.68,20.03 JP5.1
PB3/MISO/D50  (via drill 0.36)
  Top 0.254: IC2.22 39.85,32.53 49.48,22.9 v49.48,22.72
  Bottom 0.254: v49.48,22.72 51.67,22.72 JP5.2
PB5/D11  (via drill 0.36)
  Top 0.254: IC2.24 38.85,37.49 35.2,41.13 35.2,44.37 35.2,44.67 31.77,48.1 30,48.1 29.26,47.36 16.69,47.36 v13.56,44.24
  Bottom 0.254: U$11.P$4 12.75,39.33 | 14.46,41.04 U$11.P$3 12.3,43.38 12.7,43.38 v13.56,44.24
  Bottom 0.762: 12.75,39.33 14.46,41.04
PB6/D12
  Top 0.254: U$11.P$2 11.28,40.99 12.75,39.33 | 14.55,41.13 U$11.P$1 13.38,43.27 14.57,43.27 18.16,46.85 19.25,46.85 19.73,46.85 29.46,46.85 30.2,47.59 31.55,47.59 34.66,44.47 34.66,40.95 38.35,37.27 IC2.25
  Top 0.762: 12.75,39.33 14.55,41.13
PD0/SCL
  Top 0.254: 33.05,24.47 30.47,24.47 IC4.23 | 33.05,24.47 IC2.43 | R18.1 33.05,26.39 33.05,24.47
PD1/SDA  (via drill 0.36)
  Top 0.254: IC2.44 32.77,23.97 v32.24,23.44 | R4.1 29.28,29.46 29.28,28.74 29.99,28.02 arc-90 29.99,27.17 IC4.24 29.93,25.72 v31.13,25.72
  Bottom 0.254: v31.13,25.72 32.24,24.61 v32.24,23.44
PD2/RX1  (via drill 0.36)
  Top 0.254: IC2.45 33.35,23.47 33.35,21.53 v30.07,18.26
  Bottom 0.254: U$3.14 32.17,16.15 v30.07,18.26
PD3/TX1  (via drill 0.36)
  Top 0.254: IC2.46 36.63,22.98 v38.35,22.98
  Bottom 0.254: v38.35,22.98 38.48,22.85 38.48,20.23 35.6,17.36 U$3.13
PD6  (via drill 0.36)
  Top 0.254: IC2.49 35.84,21.47 35.83,21.46 35.65,21.46 35.11,20.92 35.11,19.13 31.88,15.9 30.98,15.9 v30.71,16.16 | v27.39,16.08 26.67,16.08 24.25,13.65 24.24,13.66 14.76,13.66 14.22,14.19 v14.22,15.1
  Bottom 0.254: v30.71,16.16 27.48,16.16 v27.39,16.08 | 14.53,12.73 U$10.P$4 | U$10.P$3 11.28,12.9 12.82,14.44 | v14.22,15.1 13.28,14.16 13.1,14.16
  Bottom 0.762: 12.82,14.44 13.1,14.16 14.53,12.73
PD7/D38  (via drill 0.36)
  Top 0.254: IC2.50 36.62,19.92 v31.7,15 | v28.56,14.91 26.94,14.91 24.7,12.66 14.46,12.66 U$10.P$2 14.53,12.73 | 12.73,14.53 U$10.P$1
  Top 0.762: 14.53,12.73 12.73,14.53
  Bottom 0.254: v31.7,15 28.65,15 v28.56,14.91
PE0/RX0/D0  (via drill 0.36)
  Top 0.254: IC2.2 49.85,37.62 v46.07,41.4
  Bottom 0.254: 31.25,44.27 R16.2 34.23,44.25 40.83,37.66 41.97,37.66 43.02,38.71 44.15,38.71 45.26,39.82 45.26,40.59 v46.07,41.4
PE1/TX0/D1  (via drill 0.36)
  Top 0.254: IC2.3 49.35,37.04 46.29,40.1 v46.05,40.1
  Bottom 0.254: R25.2 31.54,39.33 | R25.2 31.52,39.6 | R25.2 31.36,39.51 31.79,39.51 34.66,42.39 35.38,42.39 40.67,37.1 42.29,37.1 43.38,38.19 44.3,38.19 45.13,39.03 45.97,39.03 | 45.97,39.03 45.98,39.04 | v46.05,40.1 45.97,40.02 45.97,39.03
PE3/D5  (via drill 0.36)
  Top 0.254: IC2.5 48.35,35.42 48.85,35.92 48.85,36.46 v46.97,38.35 | v32.69,39.15 31.16,40.68 31.16,44.81 31.88,45.53 31.88,46.49 31.32,47.06 30.4,47.06 29.62,46.27 18.29,46.27 17.02,45 17.02,43.53 18.06,42.49 18.06,39.61 18.05,39.6 18.05,38.35 15.18,35.47 13.05,35.47 10.16,32.58 5.91,32.58 R20.2 | R20.2 4.15,34.33 | R20.2 Q8.1 | JP8.1 JP8.2 2.79,33.82 R20.2
  Bottom 0.254: v32.69,39.15 34.84,41.31 35.74,41.31 40.64,36.41 42.34,36.41 43.55,37.63 44.45,37.63 45.17,38.35 v46.97,38.35
PE4/D2  (via drill 0.36)
  Top 0.254: IC2.6 47.86,34.71 47.86,36.37 v47.77,36.46 | R15.2 5.39,18.45 Q1.1 7.95,20.9 v7.95,21.78 7.95,18.98 JP6.2 JP6.1
  Bottom 0.254: v47.77,36.46 47.15,37.09 43.73,37.09 42.4,35.75 40.58,35.75 39.61,36.73 38.26,38.08 37.54,38.08 22.9,23.44 9.6,23.44 v7.95,21.78
PE5/D3  (via drill 0.36)
  Top 0.254: Q6.1 35.69,5.1 36.32,5.73 36.32,6.54 R17.2 38.94,10.42 38.94,10.76 35.91,13.79 JP9.2 JP9.1 36.69,14.67 39.47,14.67 40.61,15.82 42.72,15.82 43.33,15.21 47.14,15.21 47.55,15.61 v47.55,16.68 | v48.44,29.11 47.35,30.2 IC2.7
  Bottom 0.254: v48.44,29.11 43.81,24.62 43.81,23.31 47.83,19.3 47.83,16.96 v47.55,16.68
PE6
  Top 0.254: U$8.P$1 43.07,40.99 | 39.33,41.13 U$8.P$2 | U$8.P$1 41.13,39.33 | U$8.P$1 43.37,41.58 46.16,38.8 46.16,38.08 46.85,37.39 IC2.8
  Top 0.762: 41.13,39.33 39.33,41.13
PE7  (via drill 0.36)
  Top 0.254: IC2.9 46.35,36.81 45.44,37.72 45.44,38.26 v43.64,40.05
  Bottom 0.254: v43.64,40.05 43.64,40.12 U$8.P$3 41.04,39.42 | 39.24,41.04 39.33,41.13 U$8.P$4
  Bottom 0.762: 41.04,39.42 39.33,41.13
PG0/D41  (via drill 0.36)
  Top 0.254: IC2.51 38.35,18.43 v37.69,17.77
  Bottom 0.254: GPS_DNP.1 38.53,18.61 v37.69,17.77
PG5/D4  (via drill 0.36)
  Top 0.254: IC2.1 50.35,38.2 v46.07,42.48 | v39.34,44.21 38.84,44.21 34.42,48.63 34.42,49.41 R19.2 | R19.2 37.45,49.88 Q7.1 | R19.2 34.89,50.03 | JP7.1 JP7.2 34.89,50.17 R19.2
  Bottom 0.254: v46.07,42.48 44.73,41.14 44.73,39.97 44,39.24 42.84,39.24 41.85,38.26 40.95,38.26 38.26,40.95 38.26,43.12 v39.34,44.21
PIO3  (via drill 0.36)
  Top 0.254: SJ3.1 v31.52,9.07
  Bottom 0.254: U$3.20 31.64,8.96 v31.52,9.07
PIO4  (via drill 0.36)
  Top 0.254: v31.52,6.56 31.52,5.57 SJ4.1
  Bottom 0.254: U$3.22 v31.52,6.56
PIO5  (via drill 0.36)
  Top 0.254: 27.75,11.48 R5.1
  Top 0.406: v27.75,7.81 27.75,11.48
  Bottom 0.254: 27.81,7.75 v27.75,7.81
  Bottom 0.406: U$3.21 27.81,7.75
PIO6  (via drill 0.36)
  Top 0.254: v22.72,6.56 22.72,5.57 SJ2.1
  Bottom 0.254: U$3.3 v22.72,6.56
PIO7  (via drill 0.36)
  Top 0.254: v22.72,7.81 22.72,8.98 SJ1.1
  Bottom 0.254: U$3.4 22.66,7.75 v22.72,7.81
PJ0/RXD3  (via drill 0.36)
  Top 0.254: 44.35,19.83 IC2.63 | 44.35,19.83 | 44.35,19.83 43.84,20.34 v42.44,20.41
  Bottom 0.254: GPS_DNP.4 40.76,20.65 41.32,20.08 42.49,20.08 v42.44,20.41
PJ1/TXD3  (via drill 0.36)
  Top 0.254: IC2.64 44.85,20.01 44.86,20.01 42.95,21.91 39.62,21.91 v39.27,21.56
  Bottom 0.254: GPS_DNP.3 39.27,20.77 v39.27,21.56
RESET  (via drill 0.36)
  Top 0.254: IC2.30 v38.17,30.98 38.17,33.14 36.47,34.84 | R22.1 33.4,32.51 36.1,35.2 36.47,34.84 | v33.86,42.66 34.16,42.35 34.16,37.15 36.47,34.84
  Bottom 0.254: JP5.5 48.39,30.25 41.85,23.71 41.68,23.54 38.76,23.54 37.73,24.57 37.73,24.59 37.81,29 S2.P$1 | RST1.- 34.39,25.06 36.35,27.02 S2.P$1 | v38.17,30.98 36.19,30.98 S2.P$1 | C24.1 31.29,42.66 v33.86,42.66
USB_5V
  Bottom 0.254: C10.2 14.85,47.65 F1.1
  Bottom 0.406: 17.69,49.12 20.04,49.03 22.29,46.79 X1.VBUS | 17.69,49.12 16.87,48.3 F1.1 | 17.69,49.12 17.69,49.87 JP2.2 JP2.1
VCC  (via drill 0.36, 0.6)
  Top 0.254: 15.54,23.76 IC1.1 | U$2.4 16.29,28.97 15.63,29.64 12.84,29.64 11.85,28.65 11.85,27.97 | U$2.6 15.61,27.97 15.19,27.55 12.06,27.55 11.86,27.75
  Top 0.406: 11.85,29.53 11.85,33.41 13.29,34.84 15.45,34.84 18.68,38.08 18.68,42.98 17.65,44.01 17.65,44.7 18.57,45.61 30.52,45.61 v30.98,46.07 | 11.85,29.53 11.85,28.65 | v15.36,21.82 15.45,23.67 IC1.1 | v6.11,31.07 6.73,30.45 R1.2 | 11.86,25.59 8.71,25.59 C28.+ 5.1,25.49 5.1,25.5 JP1.1 4.36,26.24 C2.1 4.27,23.98 v4.27,22.67 3.03,21.43 JP3.2 JP3.1 | 15.54,23.76 13.87,25.59 11.86,25.59 | 11.86,25.59 11.86,27.75 11.86,29.52 arc90 11.85,29.53 | 35.25,11.75 36.49,10.51 D2.+ 34.69,12.36 32.71,12.36 23.11,21.96 v22.22,21.96
  Bottom 0.406: v6.11,31.07 5.12,32.06 D4.+ 3.86,32.24 2.34,30.71 2.34,27.25 3.22,26.36 4.24,26.36 JP1.1 | D3.+ 34.39,46.07 v30.98,46.07 | D1.+ 15.36,21.09 v15.36,21.82 17.06,22.81 21.38,22.81 v22.22,21.96